# EAGLE design Fathom Drone Pi Shield (EAGLE 6.6.0)

## Sheet 1 of 5
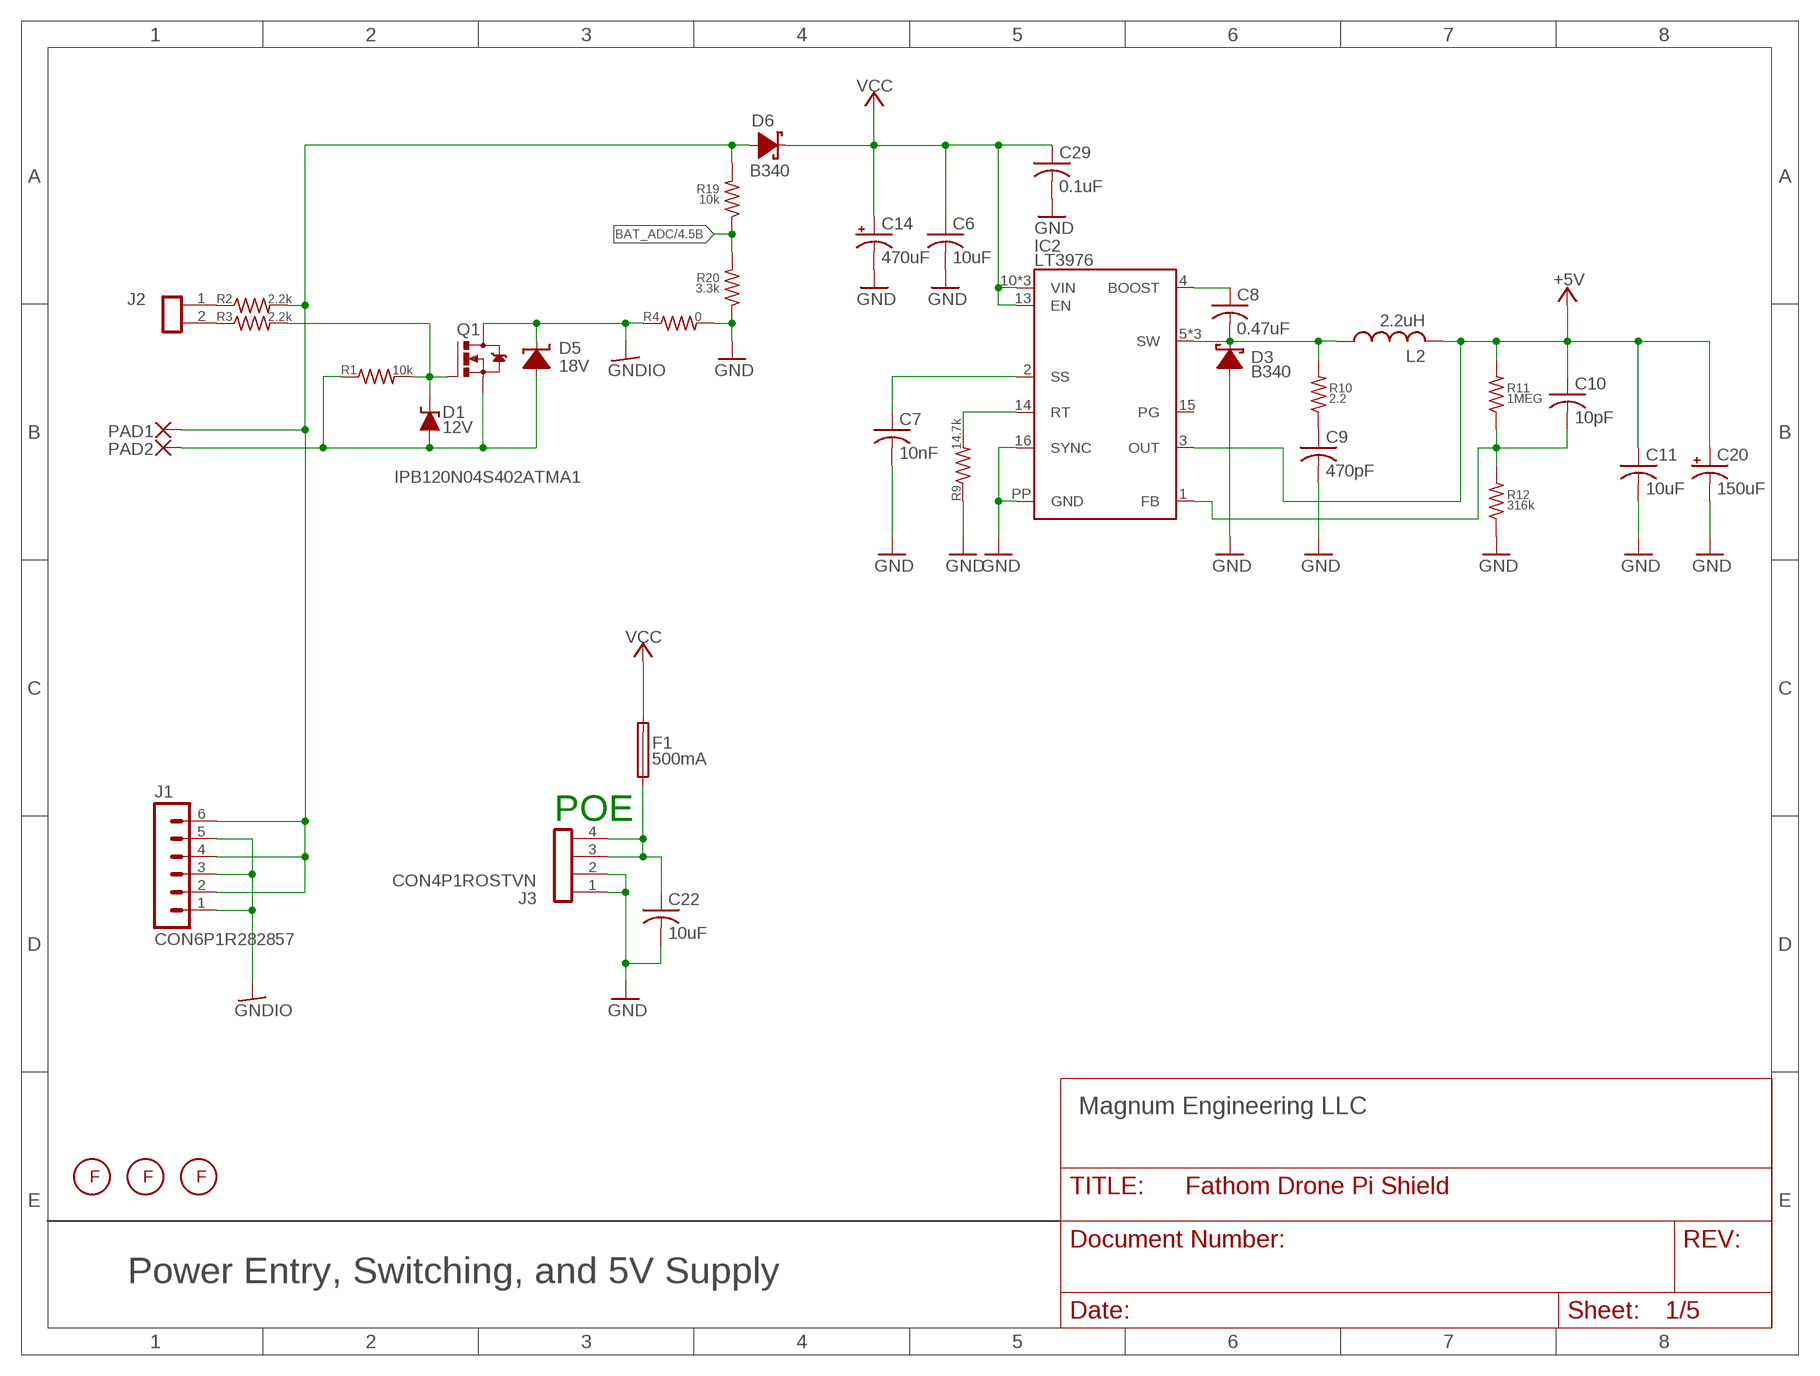
[diagram p0: schematic, sheet 1]

### Parts
C6  10uF  C-USC1206  [C1206]
C7  10nF  CAPACITOR0402  [C0402]
C8  0.47uF  CAPACITOR0603  [C0603]
C9  470pF  CAPACITOR0603  [C0603]
C10  10pF  CAPACITOR0603  [C0603]
C11  10uF  CAPACITOR0805  [C0805]
C14  470uF  CPOL-USE3.5-8  [E3,5-8]
C20  150uF  CPOL-USC  [PANASONIC_C]
C22  10uF  C-USC1206  [C1206]
C29  0.1uF  C-USC0402  [C0402]
D1  12V  ZENERSOT-23  [SOT-23]
D3  B340  DIODE-SCHOTTKYSMA  [SMA]
D5  18V  TVSSMC  [SMC]
D6  B340  DIODE-SCHOTTKYSMA  [SMA]
F1  500mA  FUSEBETTER_1812  [BETTER_LITTELFUSE1812]
FM1  FIDUCIAL1MM  [1MMCIRCLE]
FM2  FIDUCIAL1MM  [1MMCIRCLE]
FM3  FIDUCIAL1MM  [1MMCIRCLE]
IC2  LT3976  [MSOP-16-PP]
J1  CON6P1R282857  [282857-6]
J2  CON2P1ROSTVN  [OSTVN02A150]
J3  CON4P1ROSTVN  [OSTVN04A150]
L2  2.2uH  L-USVLP8040  [VLP8040]
PAD1  WIREPAD5.5/3,0  [5.5/3,0]
PAD2  WIREPAD5.5/3,0  [5.5/3,0]
Q1  IPB120N04S402ATMA1  MOSFET-NTO263  [TO263]
R1  10k  RESISTOR0603  [R0603]
R2  2.2k  RESISTOR0603  [R0603]
R3  2.2k  RESISTOR0603  [R0603]
R4  0  RESISTOR0805  [R0805]
R9  14.7k  RESISTOR0603  [R0603]
R10  2.2  RESISTOR0603  [R0603]
R11  1MEG  RESISTOR0603  [R0603]
R12  316k  RESISTOR0603  [R0603]
R19  10k  RESISTOR0603  [R0603]
R20  3.3k  RESISTOR0402  [R0402]

### Nets
+5V: C10.1 C11.1 C20.+ IC2.3(OUT) L2.P$2 R11.2 ; also sheet 2,3,4
BAT_ADC: R19.1 R20.2 ; also sheet 4
GND: C6.2 C7.2 C9.2 C11.2 C14.- C20.- C22.2 C29.2 D3.A IC2.16(SYNC) IC2.PP(GND) J3.1 J3.2 R4.2 R9.1 R12.1 R20.1 ; also sheet 2,3,4,5
GNDIO: D5.C J1.1 J1.3 J1.5 Q1.3(D) R4.1
N$1: D1.1(A) D5.A PAD2.P$1(P) Q1.2(S) R1.1
N$4: J2.1 R2.1
N$5: J2.2 R3.1
N$12: D6.A J1.2 J1.4 J1.6 PAD1.P$1(P) R2.2 R19.2
N$13: C7.1 IC2.2(SS)
N$14: IC2.14(RT) R9.2
N$15: C8.2 D3.C IC2.5(SW) IC2.6(SW) IC2.7(SW) L2.P$1 R10.2
N$16: C8.1 IC2.4(BOOST)
N$17: C9.1 R10.1
N$18: C10.2 IC2.1(FB) R11.1 R12.2
N$26: D1.3(K) Q1.1(G) R1.2 R3.2
N$44: C22.1 F1.P$1 J3.3 J3.4
VCC: C6.1 C14.+ C29.1 D6.C F1.P$2 IC2.10(VIN) IC2.11(VIN) IC2.12(VIN) IC2.13(EN) ; also sheet 3
Unconnected: IC2.15(PG)

### Notes on the sheet
- POE

## Sheet 2 of 5
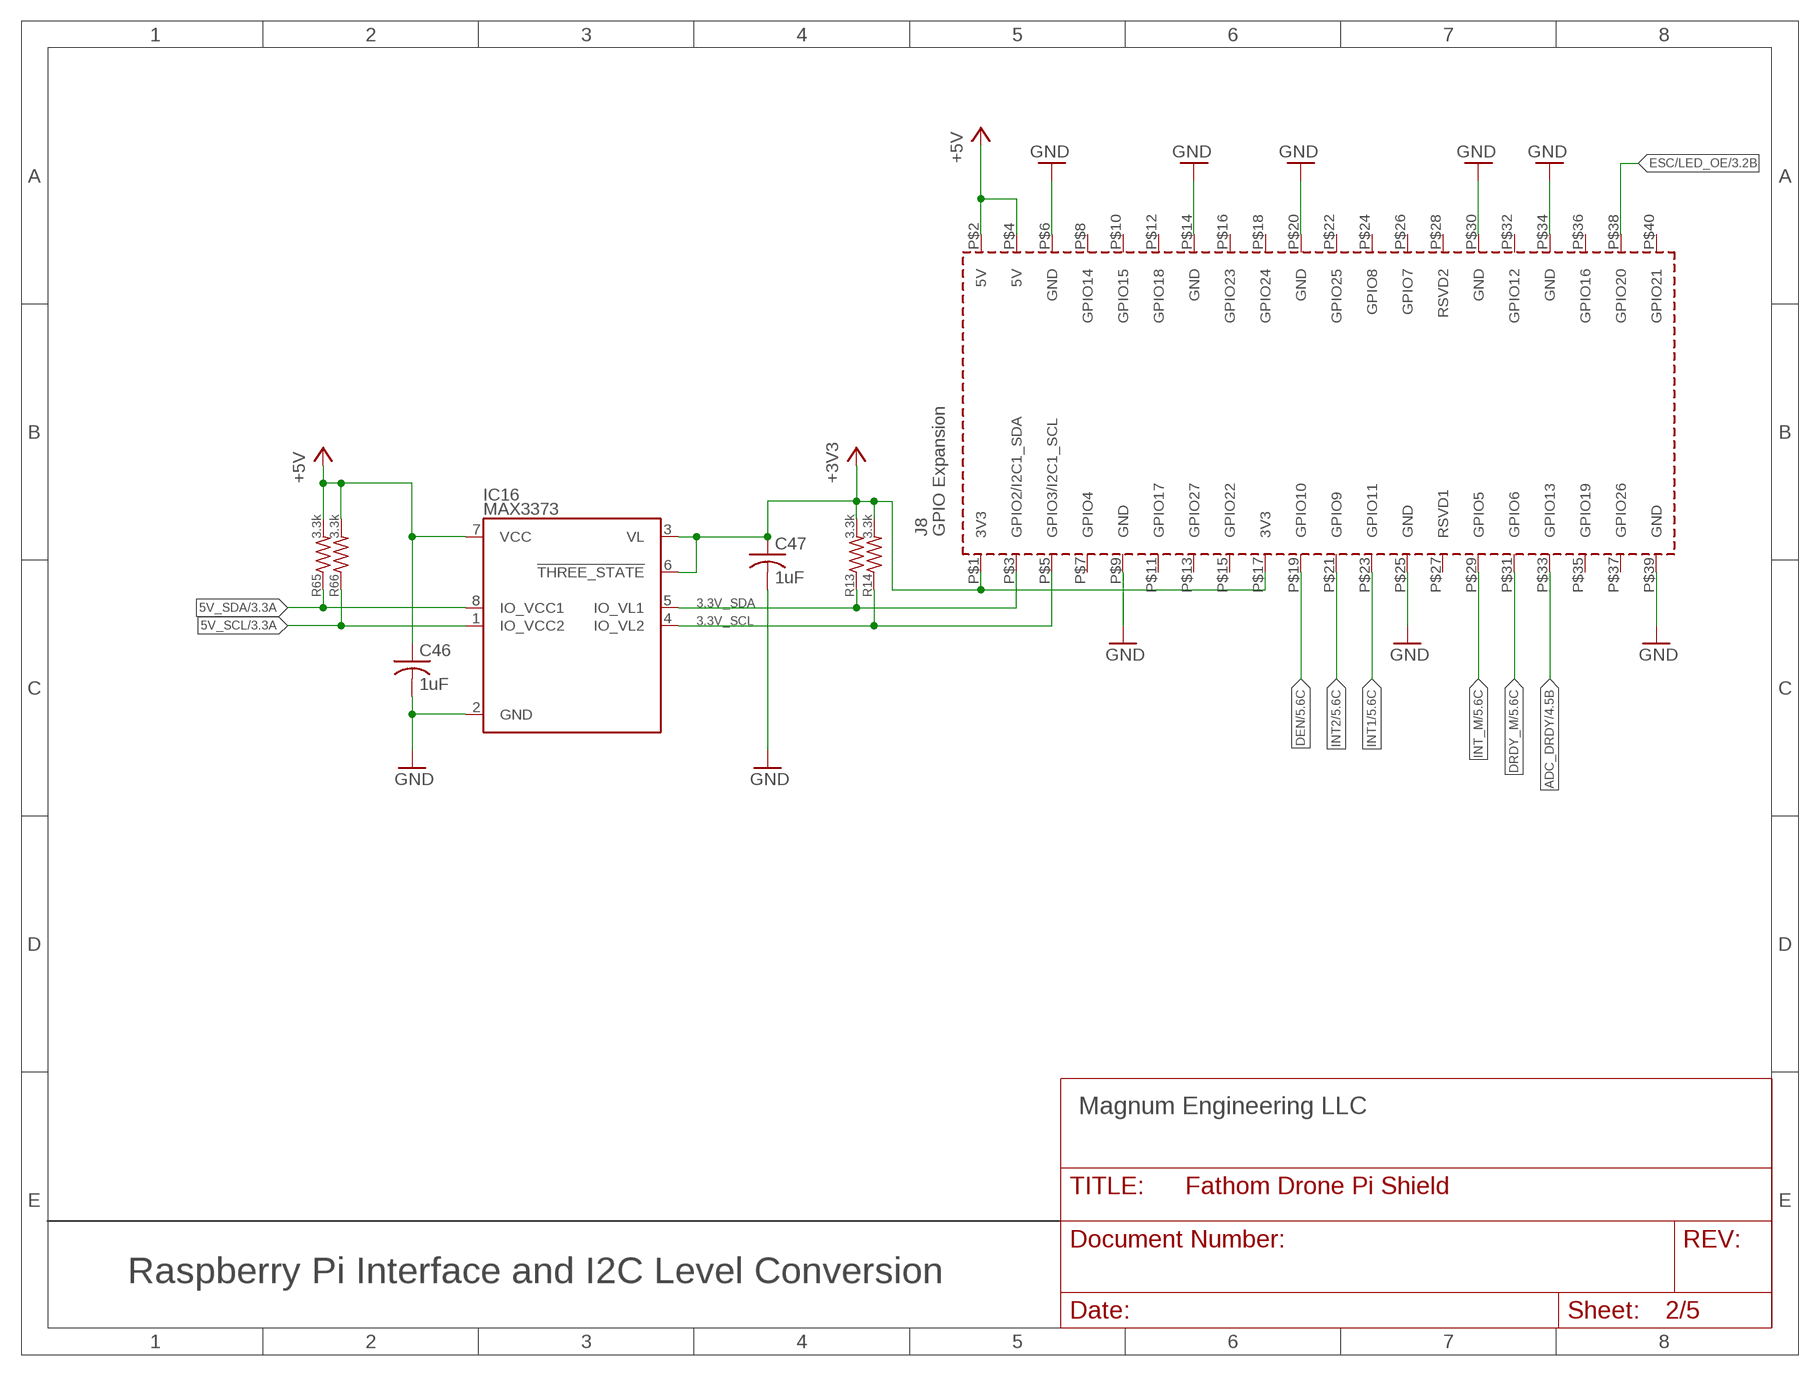
[diagram p1: schematic, sheet 2]

### Parts
C46  1uF  CAPACITOR0402  [C0402]
C47  1uF  CAPACITOR0402  [C0402]
IC16  MAX3373  [TS8]
PCB1  RPI3  [RPI3]
R13  3.3k  RESISTOR0402  [R0402]
R14  3.3k  RESISTOR0402  [R0402]
R65  3.3k  RESISTOR0402  [R0402]
R66  3.3k  RESISTOR0402  [R0402]

### Nets
3.3V_SCL: IC16.4(IO_VL2) PCB1.P$5(GPIO3/I2C1_SCL) R14.1 ; also sheet 5
3.3V_SDA: IC16.5(IO_VL1) PCB1.P$3(GPIO2/I2C1_SDA) R13.1 ; also sheet 5
5V_SCL: IC16.1(IO_VCC2) R66.1 ; also sheet 3,4
5V_SDA: IC16.8(IO_VCC1) R65.1 ; also sheet 3,4
+3V3: C47.1 IC16.3(VL) IC16.6(!THREE_STATE) PCB1.P$1(3V3) PCB1.P$17(3V3) R13.2 R14.2 ; also sheet 4,5
+5V: C46.1 IC16.7(VCC) PCB1.P$2(5V) PCB1.P$4(5V) R65.2 R66.2 ; also sheet 1,3,4
ADC_DRDY: PCB1.P$33(GPIO13) ; also sheet 4
DEN: PCB1.P$19(GPIO10) ; also sheet 5
DRDY_M: PCB1.P$31(GPIO6) ; also sheet 5
ESC/LED_OE: PCB1.P$38(GPIO20) ; also sheet 3
GND: C46.2 C47.2 IC16.2(GND) PCB1.P$6(GND) PCB1.P$9(GND) PCB1.P$14(GND) PCB1.P$20(GND) PCB1.P$25(GND) PCB1.P$30(GND) PCB1.P$34(GND) PCB1.P$39(GND) ; also sheet 1,3,4,5
INT1: PCB1.P$23(GPIO11) ; also sheet 5
INT2: PCB1.P$21(GPIO9) ; also sheet 5
INT_M: PCB1.P$29(GPIO5) ; also sheet 5
Unconnected: PCB1.P$7(GPIO4) PCB1.P$8(GPIO14) PCB1.P$10(GPIO15) PCB1.P$11(GPIO17) PCB1.P$12(GPIO18) PCB1.P$13(GPIO27) PCB1.P$15(GPIO22) PCB1.P$16(GPIO23) PCB1.P$18(GPIO24) PCB1.P$22(GPIO25) PCB1.P$24(GPIO8) PCB1.P$26(GPIO7) PCB1.P$27(RSVD1) PCB1.P$28(RSVD2) PCB1.P$32(GPIO12) PCB1.P$35(GPIO19) PCB1.P$36(GPIO16) PCB1.P$37(GPIO26) PCB1.P$40(GPIO21)

## Sheet 3 of 5
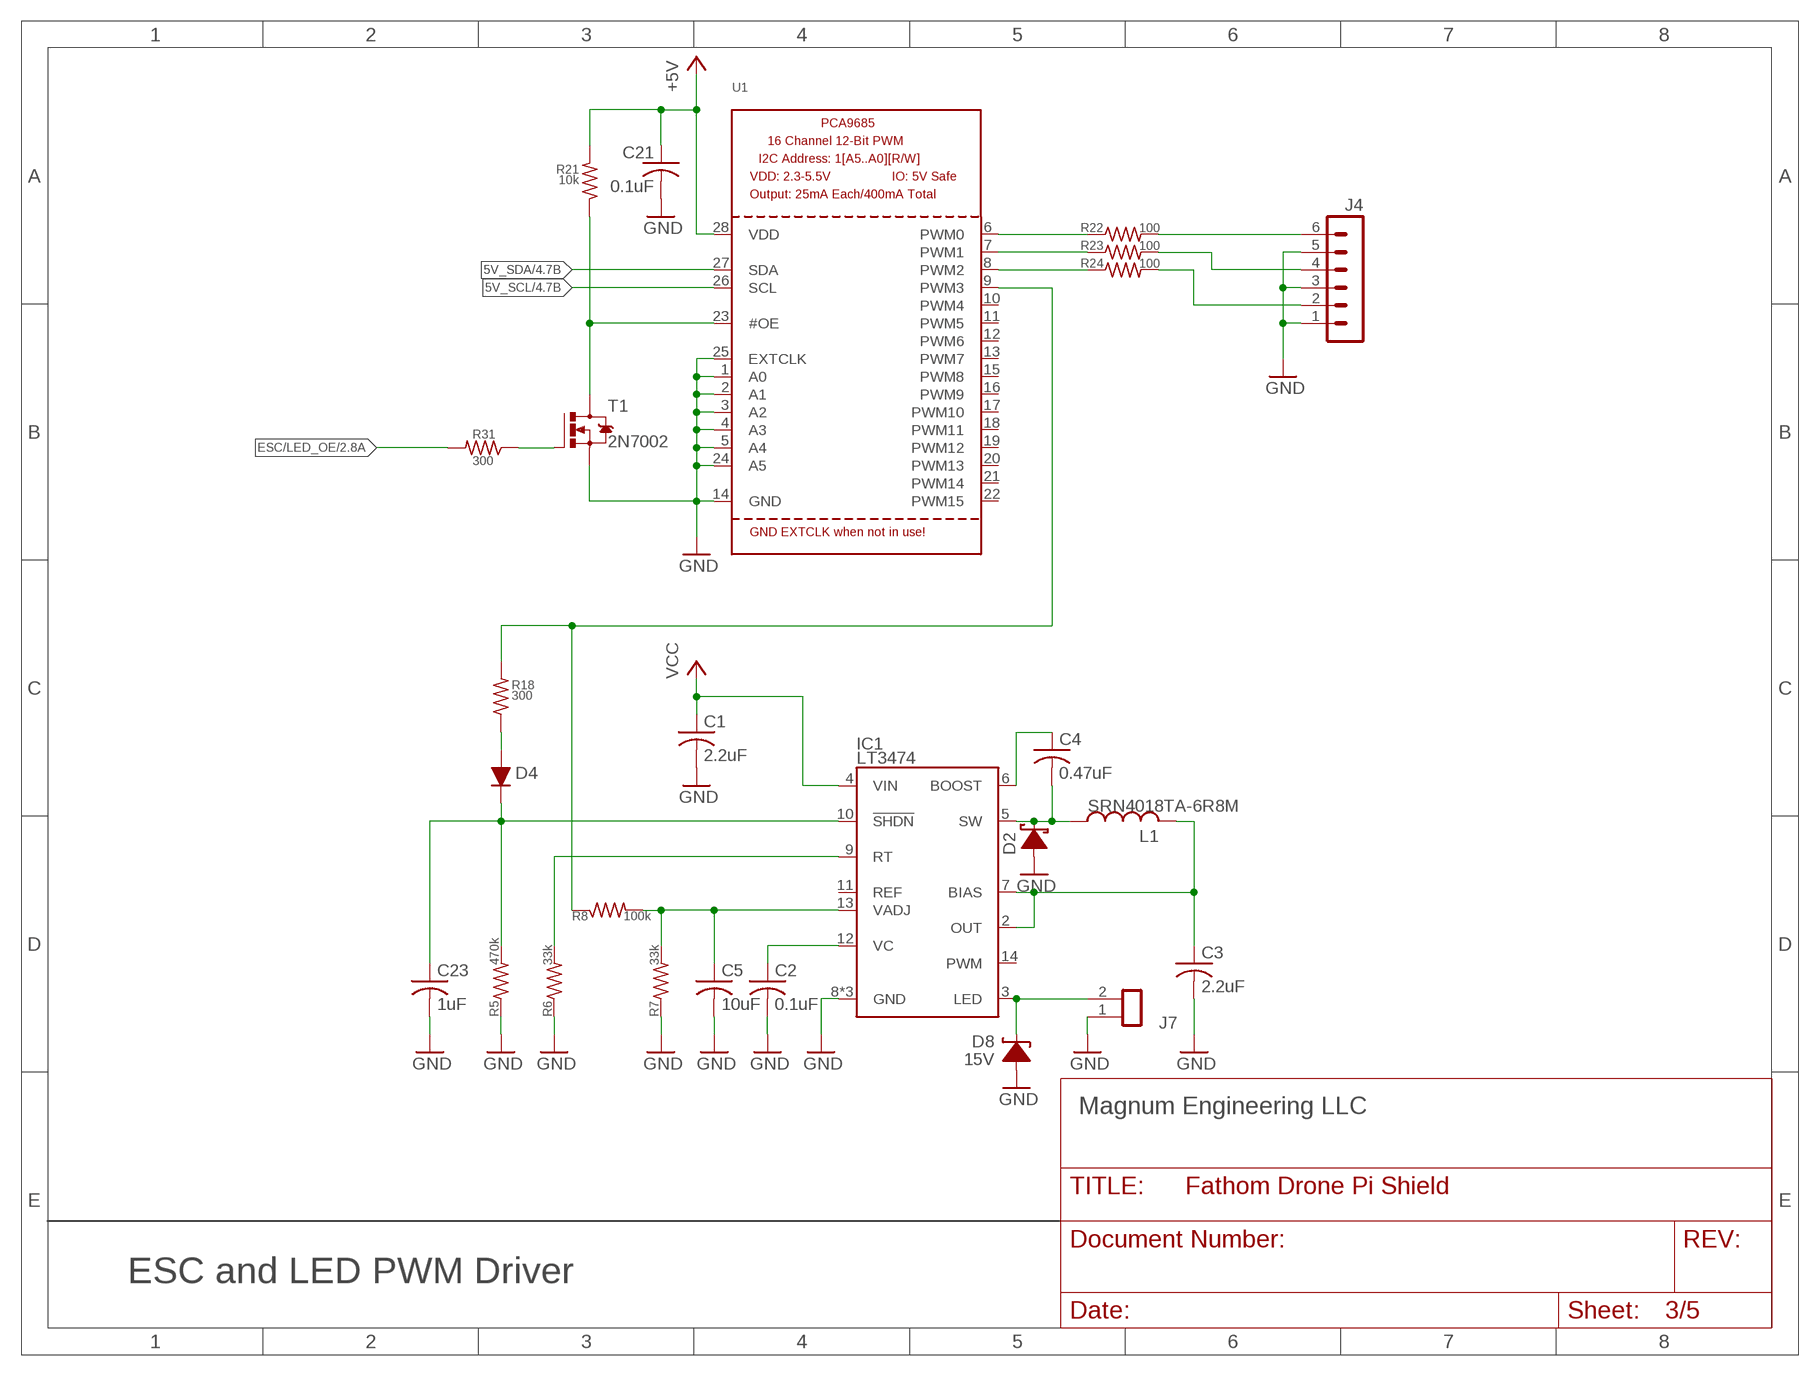
[diagram p2: schematic, sheet 3]

### Parts
C1  2.2uF  CAPACITOR0603  [C0603]
C2  0.1uF  CAPACITOR0402  [C0402]
C3  2.2uF  CAPACITOR0603  [C0603]
C4  0.47uF  CAPACITOR0603  [C0603]
C5  10uF  CAPACITOR0805  [C0805]
C21  0.1uF  CAPACITOR0402  [C0402]
C23  1uF  CAPACITOR0402  [C0402]
D2  DIODE-SCHOTTKYSMA  [SMA]
D4  DIODESOD-123  [SOD-123]
D8  15V  TVSSOD123FL  [SOD123FL]
IC1  LT3474  [TSSOP16_PP]
J4  CON6P1ROSTVN  [OSTVN06A150]
J7  CON2P1ROSTVN  [OSTVN02A150]
L1  SRN4018TA-6R8M  L-US4026  [L-4026]
R5  470k  RESISTOR0603  [R0603]
R6  33k  RESISTOR0603  [R0603]
R7  33k  RESISTOR0603  [R0603]
R8  100k  RESISTOR0603  [R0603]
R18  300  RESISTOR0402  [R0402]
R21  10k  RESISTOR0603  [R0603]
R22  100  RESISTOR0603  [R0603]
R23  100  RESISTOR0603  [R0603]
R24  100  RESISTOR0603  [R0603]
R31  300  RESISTOR0402  [R0402]
T1  2N7002  N-MOSFET  [SOT-23]
U1  PCA9685  [TSSOP28]

### Nets
5V_SCL: U1.26(SCL) ; also sheet 2,4
5V_SDA: U1.27(SDA) ; also sheet 2,4
+5V: C21.1 R21.2 U1.28(VDD) ; also sheet 1,2,4
ESC/LED_OE: R31.2 ; also sheet 2
GND: C1.2 C2.2 C3.2 C5.2 C21.2 C23.2 D2.A D8.A IC1.8(GND) IC1.15(GND) IC1.PP(GND) J4.1 J4.3 J4.5 J7.1 R5.1 R6.1 R7.1 T1.2(S) U1.1(A0) U1.2(A1) U1.3(A2) U1.4(A3) U1.5(A4) U1.14(GND) U1.24(A5) U1.25(EXTCLK) ; also sheet 1,2,4,5
N$2: IC1.9(RT) R6.2
N$3: R21.1 T1.3(D) U1.23(#OE)
N$6: C2.1 IC1.12(VC)
N$7: D8.K(C) IC1.3(LED) J7.2
N$8: C3.1 IC1.2(OUT) IC1.7(BIAS) L1.P$2
N$9: C4.2 D2.C IC1.5(SW) L1.P$1
N$10: C4.1 IC1.6(BOOST)
N$11: C5.1 IC1.13(VADJ) R7.2 R8.2
N$27: R22.1 U1.6(PWM0)
N$28: R23.1 U1.7(PWM1)
N$29: R24.1 U1.8(PWM2)
N$30: R8.1 R18.2 U1.9(PWM3)
N$31: J4.6 R22.2
N$34: J4.4 R23.2
N$35: J4.2 R24.2
N$36: C23.1 D4.K IC1.10(!SHDN) R5.2
N$37: D4.A R18.1
N$41: R31.1 T1.1(G)
VCC: C1.1 IC1.4(VIN) ; also sheet 1
Unconnected: IC1.11(REF) IC1.14(PWM) U1.10(PWM4) U1.11(PWM5) U1.12(PWM6) U1.13(PWM7) U1.15(PWM8) U1.16(PWM9) U1.17(PWM10) U1.18(PWM11) U1.19(PWM12) U1.20(PWM13) U1.21(PWM14) U1.22(PWM15)

## Sheet 4 of 5
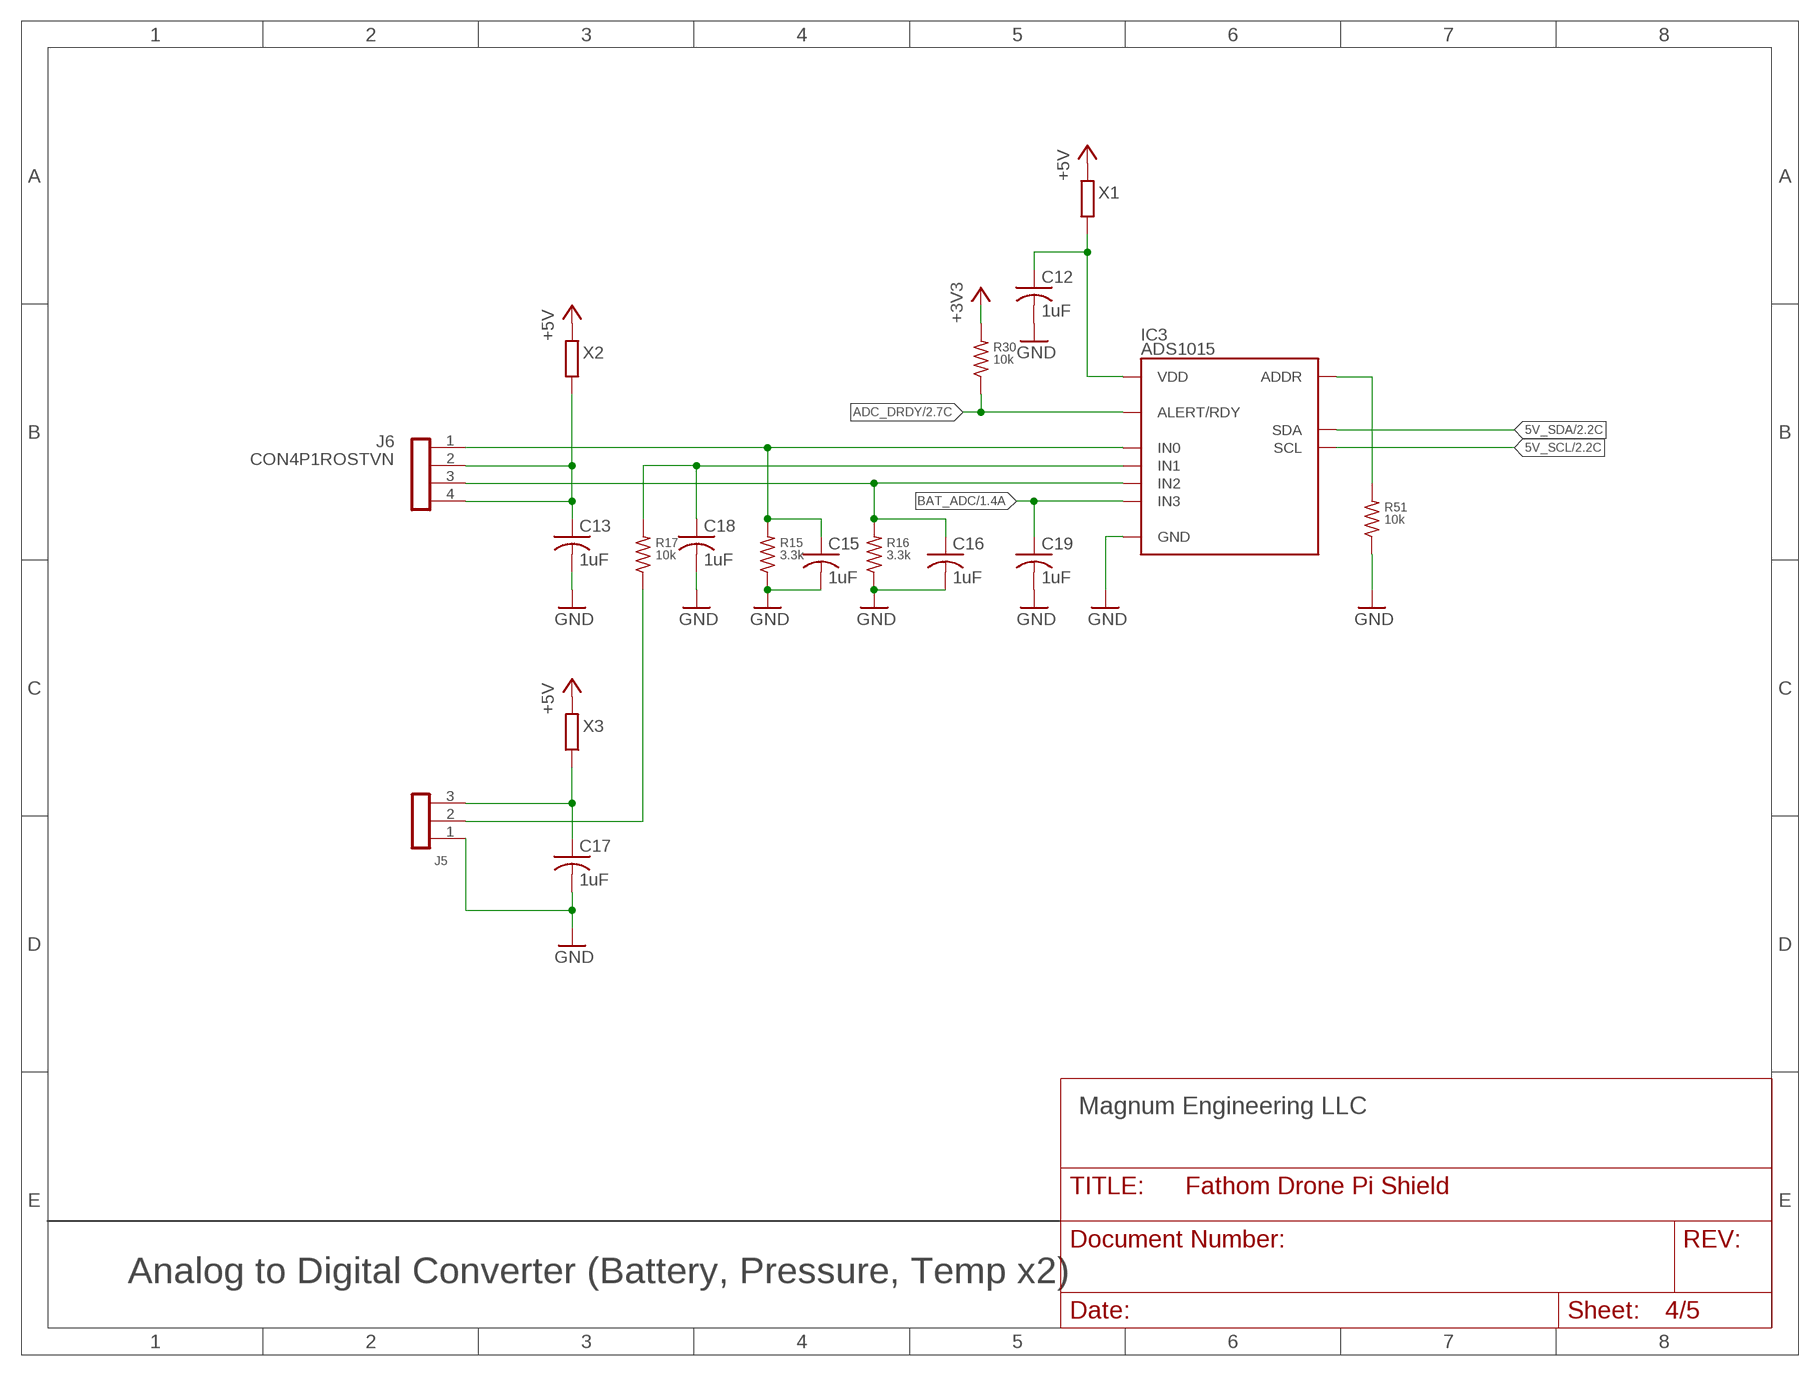
[diagram p3: schematic, sheet 4]

### Parts
C12  1uF  CAPACITOR0402  [C0402]
C13  1uF  CAPACITOR0402  [C0402]
C15  1uF  CAPACITOR0402  [C0402]
C16  1uF  CAPACITOR0402  [C0402]
C17  1uF  CAPACITOR0402  [C0402]
C18  1uF  CAPACITOR0402  [C0402]
C19  1uF  CAPACITOR0402  [C0402]
IC3  ADS1015  [MSOP10]
J5  CON3P1ROSTVN  [OSTVN03A150]
J6  CON4P1ROSTVN  [OSTVN04A150]
R15  3.3k  RESISTOR0402  [R0402]
R16  3.3k  RESISTOR0402  [R0402]
R17  10k  RESISTOR0603  [R0603]
R30  10k  RESISTOR0603  [R0603]
R51  10k  RESISTOR0603  [R0603]
X1  PASSIVE0603  [R0603@1]
X2  PASSIVE0603  [R0603@1]
X3  PASSIVE0603  [R0603@1]

### Nets
5V_SCL: IC3.10(SCL) ; also sheet 2,3
5V_SDA: IC3.9(SDA) ; also sheet 2,3
+3V3: R30.2 ; also sheet 2,5
+5V: X1.2 X2.2 X3.2 ; also sheet 1,2,3
ADC_DRDY: IC3.2(ALERT/RDY) R30.1 ; also sheet 2
BAT_ADC: C19.1 IC3.7(IN3) ; also sheet 1
GND: C12.2 C13.2 C15.2 C16.2 C17.2 C18.2 C19.2 IC3.3(GND) J5.1 R15.1 R16.1 R51.1 ; also sheet 1,2,3,5
N$19: C15.1 IC3.4(IN0) J6.1 R15.2
N$20: C16.1 IC3.6(IN2) J6.3 R16.2
N$21: C13.1 J6.2 J6.4 X2.1
N$22: C17.1 J5.3 X3.1
N$23: C12.1 IC3.8(VDD) X1.1
N$24: J5.2 R17.1
N$25: C18.1 IC3.5(IN1) R17.2
N$79: IC3.1(ADDR) R51.2

## Sheet 5 of 5
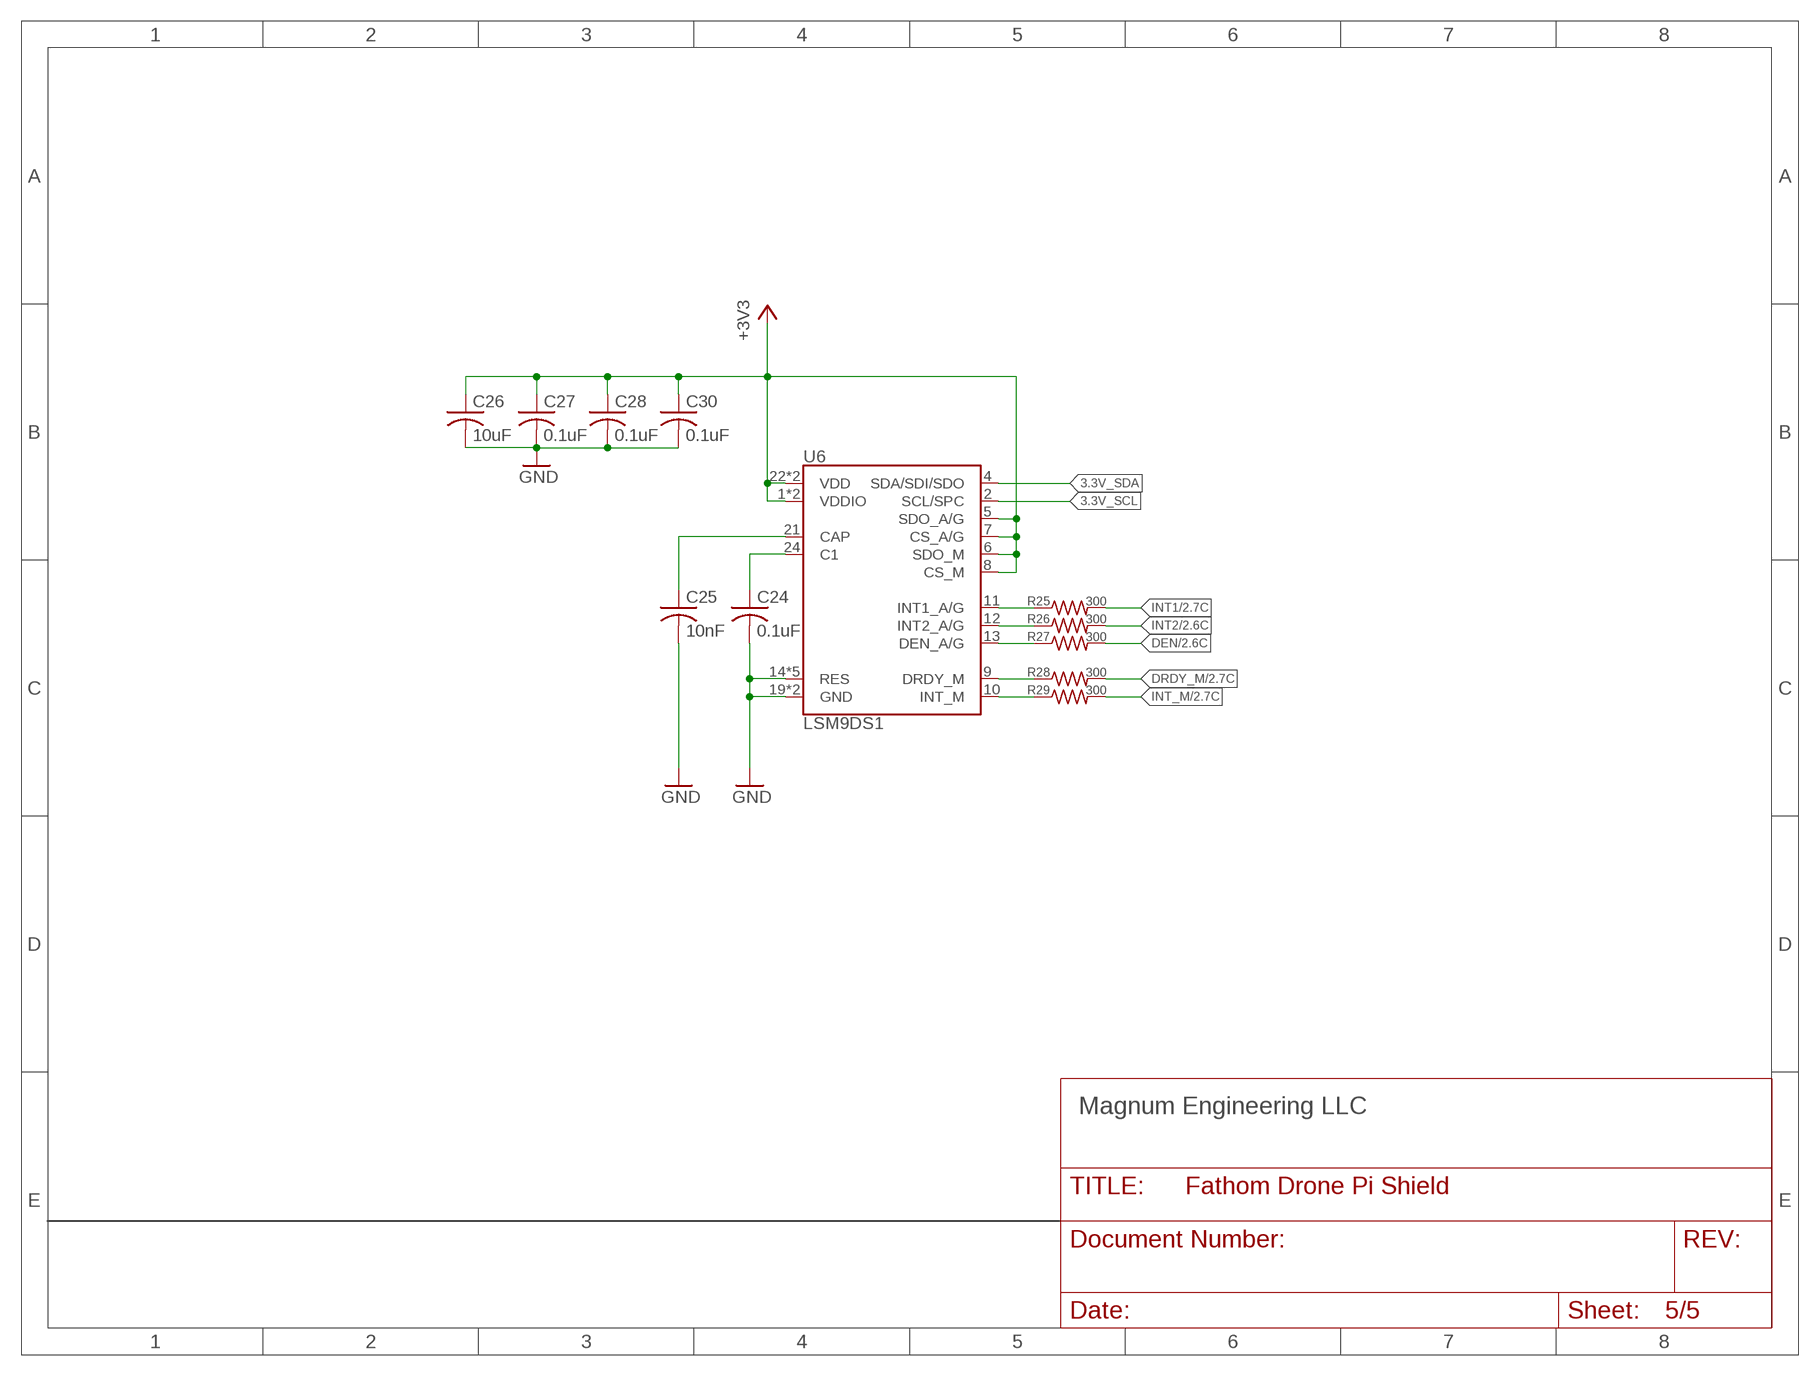
[diagram p4: schematic, sheet 5]

### Parts
C24  0.1uF  CAPACITOR0402  [C0402]
C25  10nF  CAPACITOR0402  [C0402]
C26  10uF  CAPACITOR0805  [C0805]
C27  0.1uF  CAPACITOR0402  [C0402]
C28  0.1uF  CAPACITOR0402  [C0402]
C30  0.1uF  CAPACITOR0402  [C0402]
R25  300  RESISTOR0402  [R0402]
R26  300  RESISTOR0402  [R0402]
R27  300  RESISTOR0402  [R0402]
R28  300  RESISTOR0402  [R0402]
R29  300  RESISTOR0402  [R0402]
U6  LSM9DS1  [LGA24-8X4]

### Nets
3.3V_SCL: U6.2(SCL/SPC) ; also sheet 2
3.3V_SDA: U6.4(SDA/SDI/SDO) ; also sheet 2
+3V3: C26.1 C27.1 C28.1 C30.1 U6.1(VDDIO) U6.3(VDDIO) U6.5(SDO_A/G) U6.6(SDO_M) U6.7(CS_A/G) U6.8(CS_M) U6.22(VDD) U6.23(VDD) ; also sheet 2,4
DEN: R27.2 ; also sheet 2
DRDY_M: R28.2 ; also sheet 2
GND: C24.2 C25.2 C26.2 C27.2 C28.2 C30.2 U6.14(RES) U6.15(RES) U6.16(RES) U6.17(RES) U6.18(RES) U6.19(GND) U6.20(GND) ; also sheet 1,2,3,4
INT1: R25.2 ; also sheet 2
INT2: R26.2 ; also sheet 2
INT_M: R29.2 ; also sheet 2
N$32: R25.1 U6.11(INT1_A/G)
N$33: R26.1 U6.12(INT2_A/G)
N$38: R27.1 U6.13(DEN_A/G)
N$39: R28.1 U6.9(DRDY_M)
N$40: R29.1 U6.10(INT_M)
N$42: C24.1 U6.24(C1)
N$43: C25.1 U6.21(CAP)

## Library data of the parts
C1-C5 C7-C13 C15-C19 C21 C23-C28 C30 C46 C47 = Magnum Stock Parts:CAPACITOR
C6 C22 C29 = Magnum:C-US: CAPACITOR, American symbol
C14 C20 = Magnum:CPOL-US: POLARIZED CAPACITOR, American symbol
D1 = Magnum Stock Parts:ZENER: Zener Diode
D2 D3 D6 = Magnum Stock Parts:DIODE-SCHOTTKY: Schottky Diode
D4 = Magnum Stock Parts:DIODE: Diode
D5 D8 = ads4:TVS: 2-terminal Transient Voltage Suppressor
F1 = ads4:FUSE: Fuse
FM1-FM3 = ads4:FIDUCIAL: Fiducial marks
IC1 = Magnum:LT3474
IC2 = Magnum:LT3976
IC3 = Magnum:ADS1015
IC16 = Magnum:MAX3373
J1 J4 = Magnum:CON6P1R
J2 J7 = Magnum:CON2P1R: 2-Pin Single Row Header Strip
J3 J6 = Magnum:CON4P1R
J5 = Magnum:CON3P1R
L1 L2 = Magnum:L-US: INDUCTOR, American symbol
PAD1 PAD2 = wirepad:WIREPAD: Wire PAD connect wire on PCB
PCB1 = e14_Rpi3_RevA:RPI3: Device for Raspberry Pi 3 board created by Dave Young for www.element14.com More information and support community is available at https://www.element14.com/community/community/raspberry-pi
Q1 = Magnum:MOSFET-N: N-Channel MOSFET
R1-R31 R51 R65 R66 = Magnum Stock Parts:RESISTOR
T1 = Magnum Stock Parts:N-MOSFET: 2N7002 or Similar
U1 = adafruit:PCA9685: PCA9685 - 16 Channel 12-Bit I2C PWM Controller 5.0V tolerant 16 channel, 12-bit I2C PWM controller with 25mA per output (max. 400mA total) Digikey: 568-5931-1-ND
U6 = SparkFun-Sensors:LSM9DS1: LSM9DS1 3D accelerometer, gyroscope & magnetometer The LSM9DS1 is a system-in-package featuring a 3D digital linear acceleration sensor, a 3D digital angular rate sensor, and a 3D digital magnetic sensor. The LSM9DS1 has a linear acceleration full scale of ±2g/±4g/±8/±16 g, a magnetic field full scale of ±4/±8/±12/±16 gauss and an angular rate of ±245/±500/±2000 dps. The LSM9DS1 includes an I2 C serial bus interface supporting standard and fast mode (100 kHz and 400 kHz) and an SPI serial standard interface. Magnetic, accelerometer and gyroscope sensing can be enabled or set in power-down mode separately for smart power management. The LSM9DS1 is available in a plastic land grid array package (LGA) and it is guaranteed to operate over an extended temperature range from -40 °C to +85 °C.; PROD_ID: IC-12536
X1-X3 = Magnum Stock Parts:PASSIVE

## Board
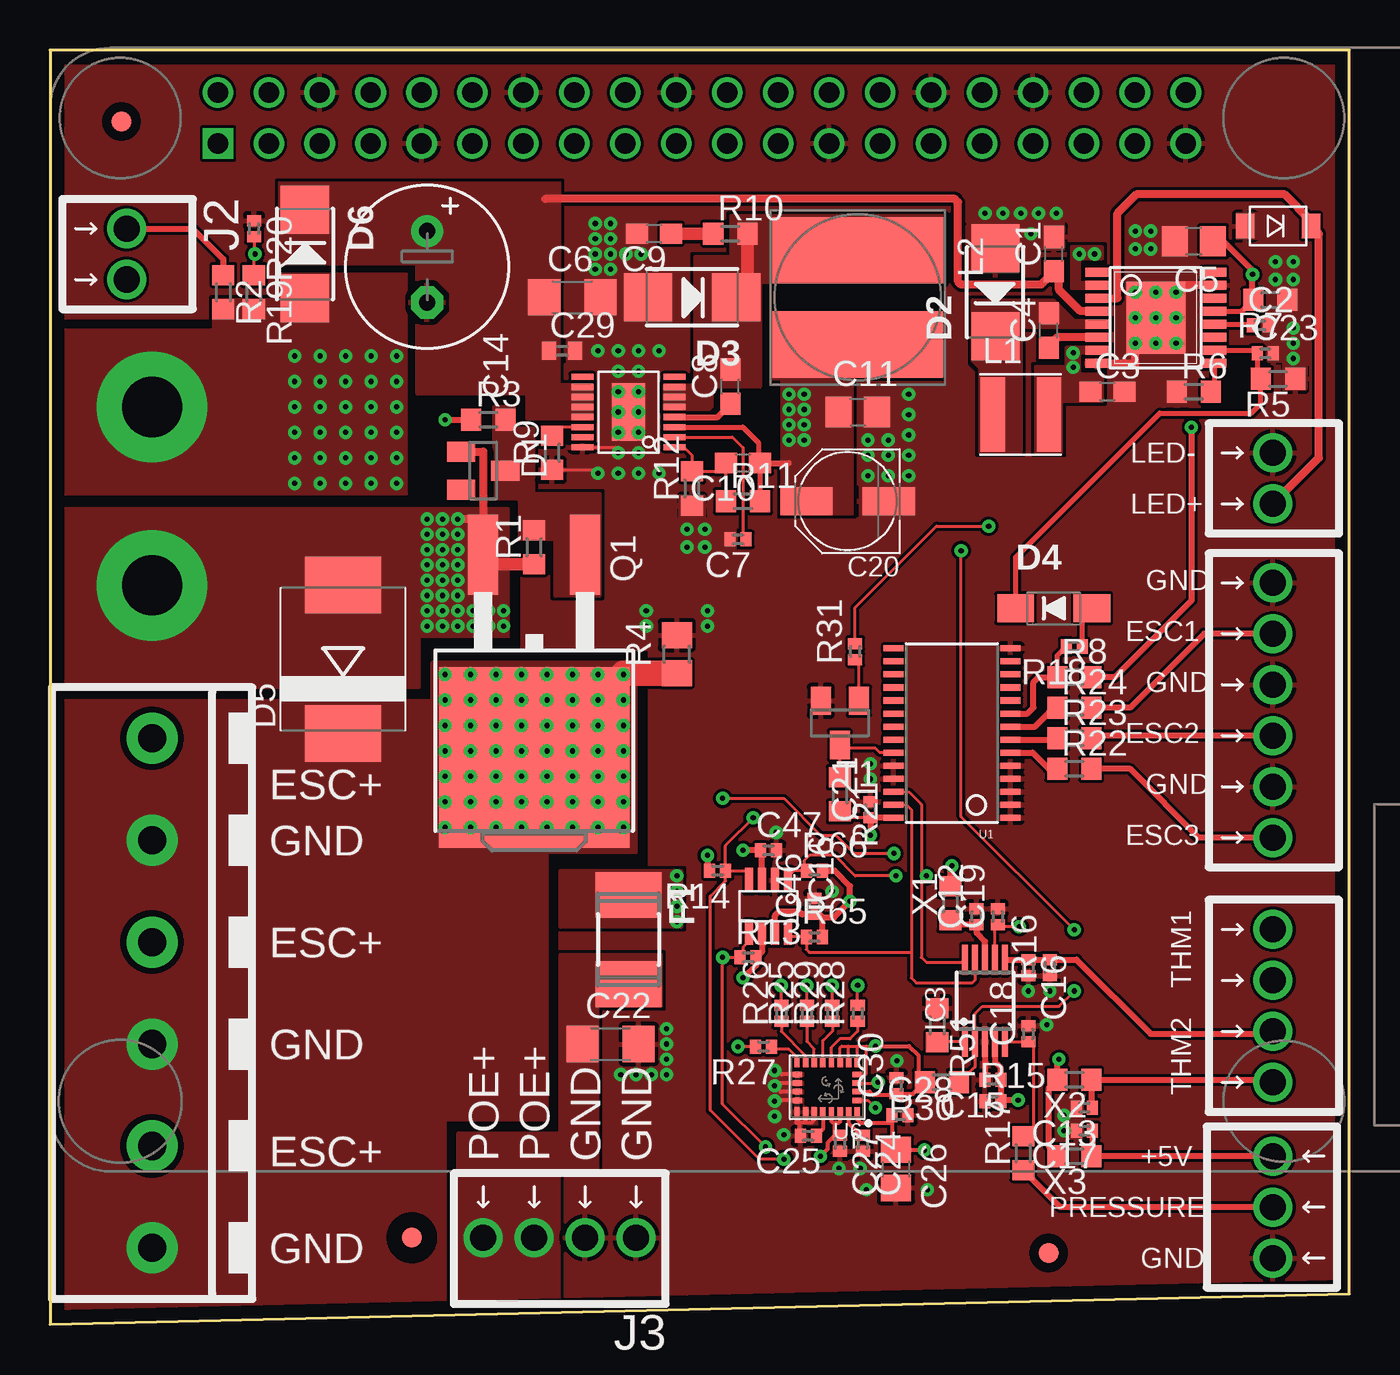
[diagram p5: board, top side]
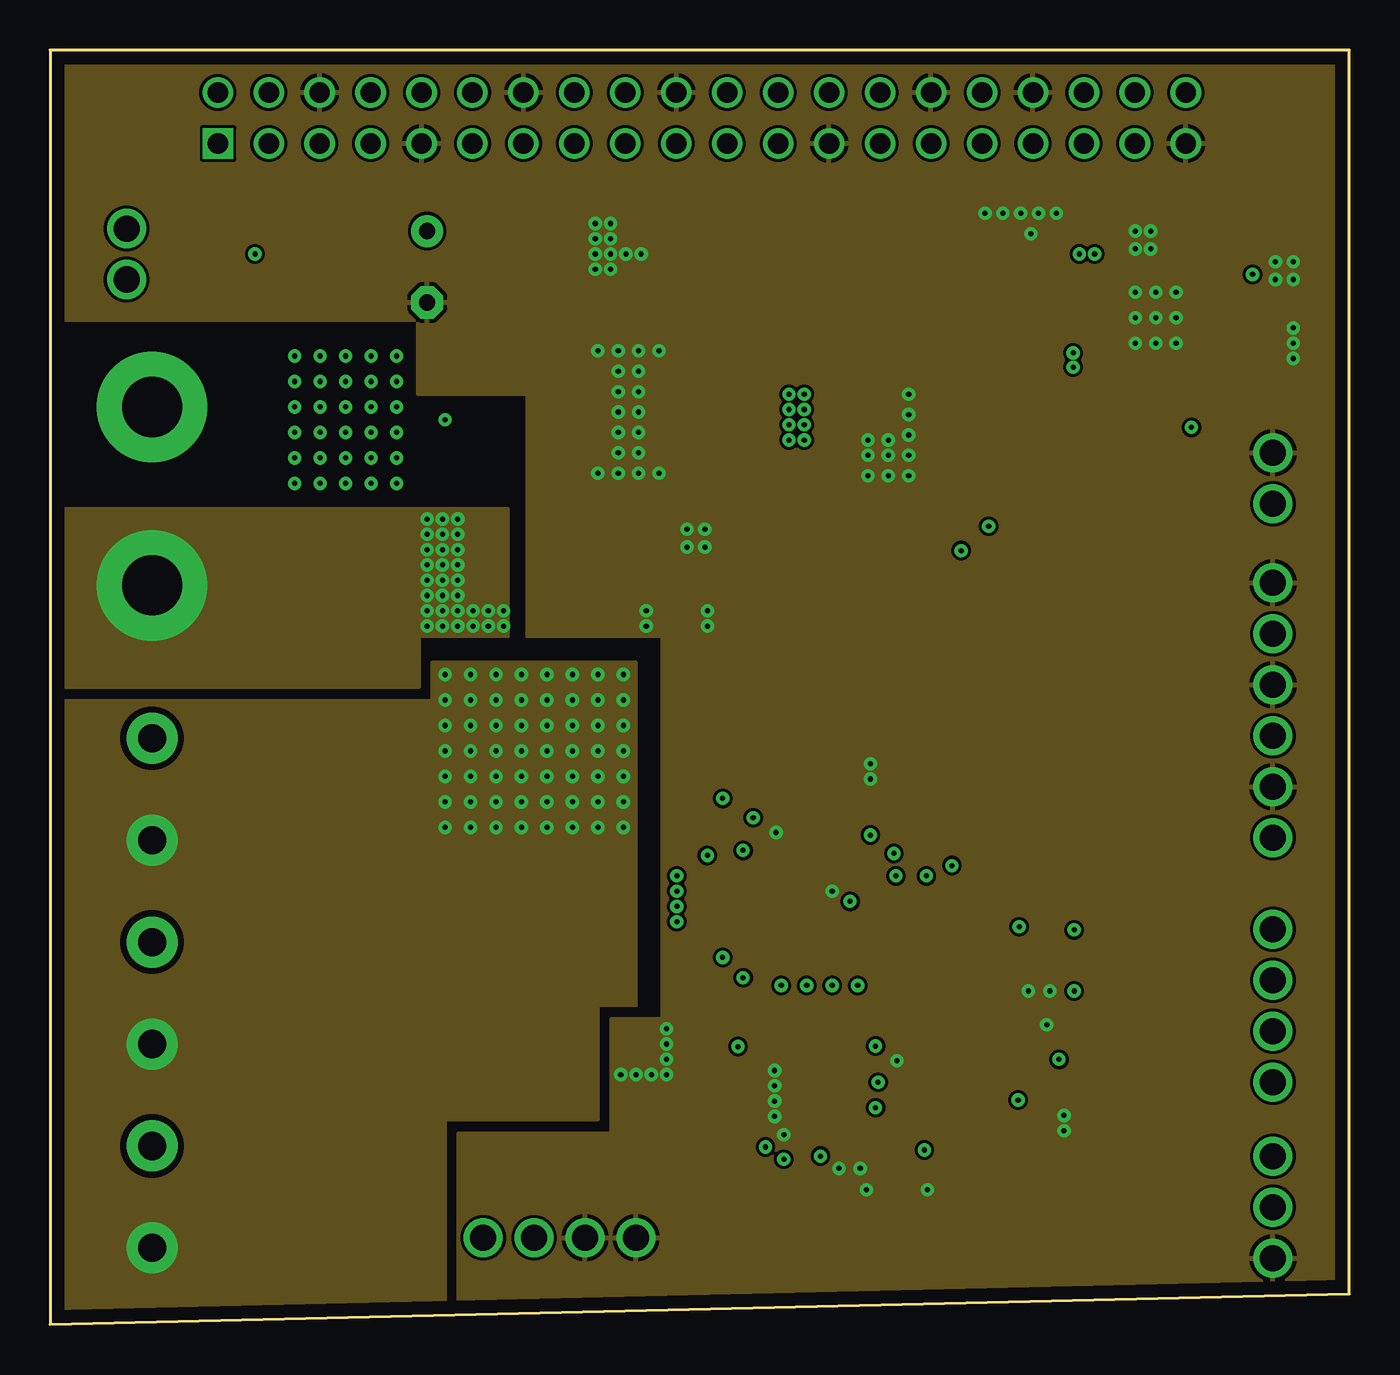
[diagram p6: board, inner layer Route2]
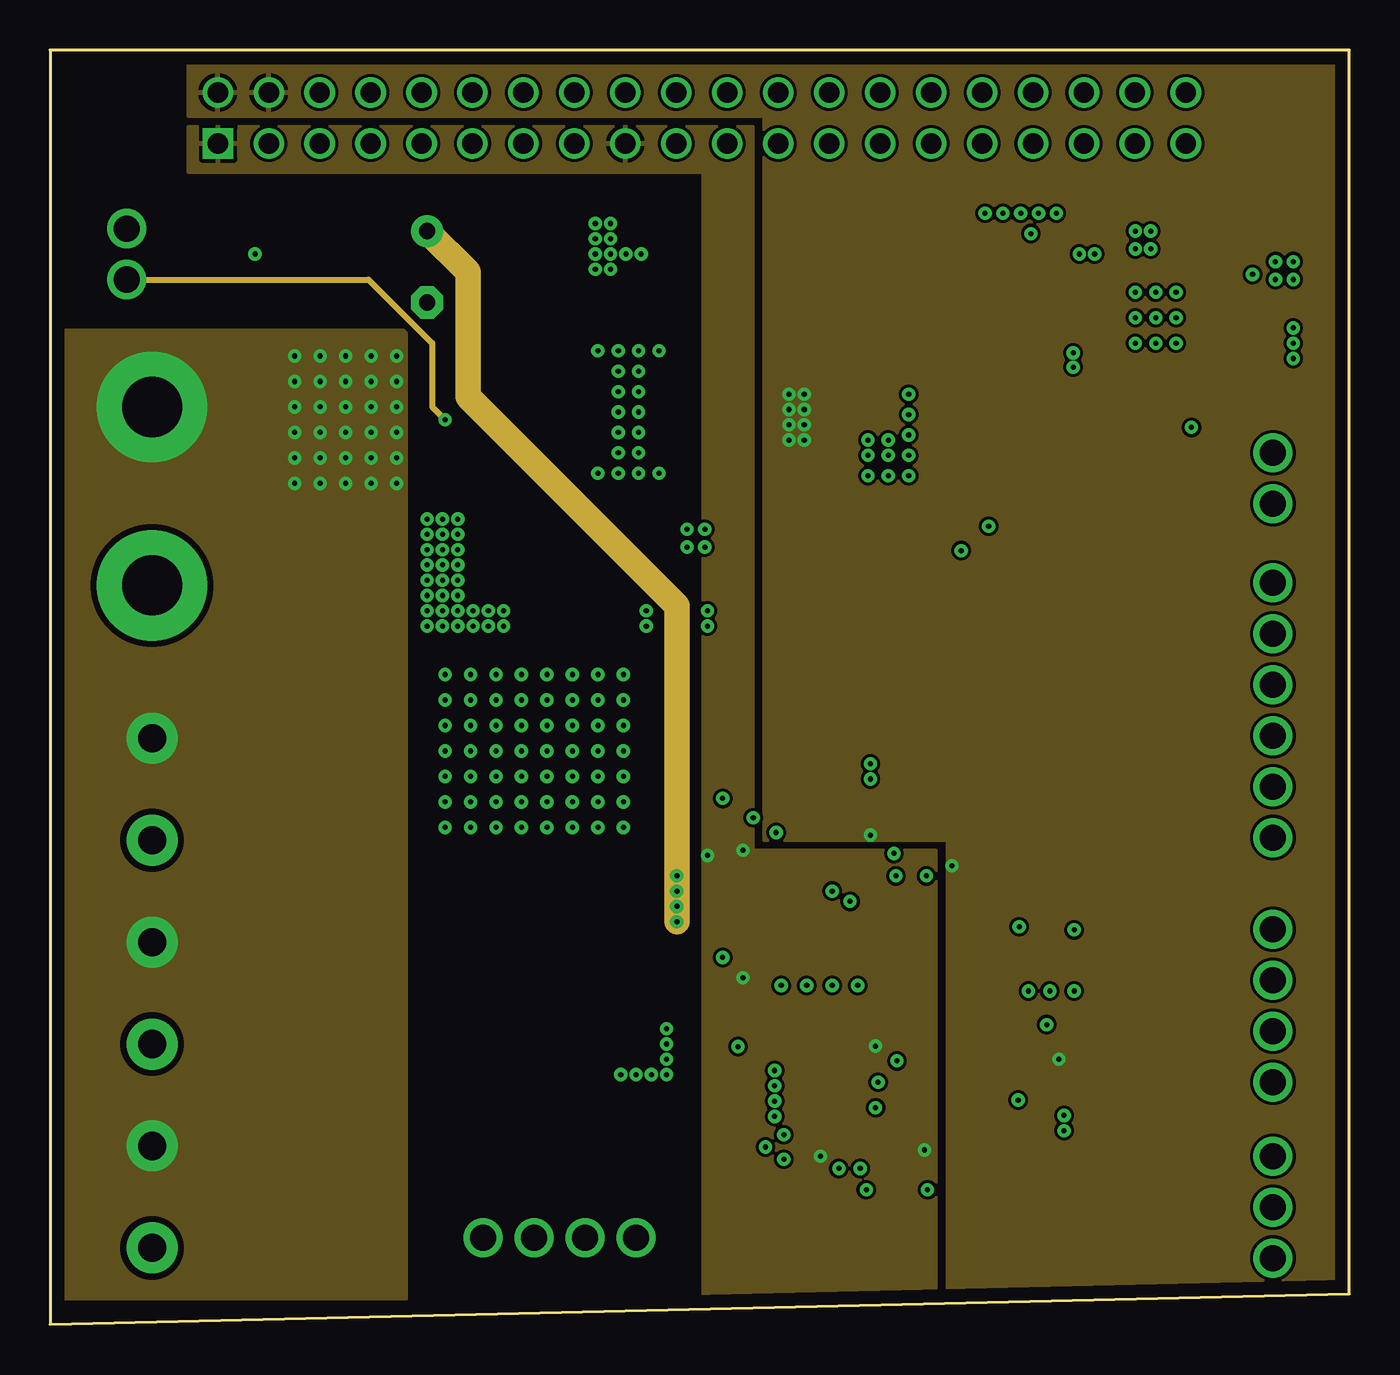
[diagram p7: board, inner layer Route15]
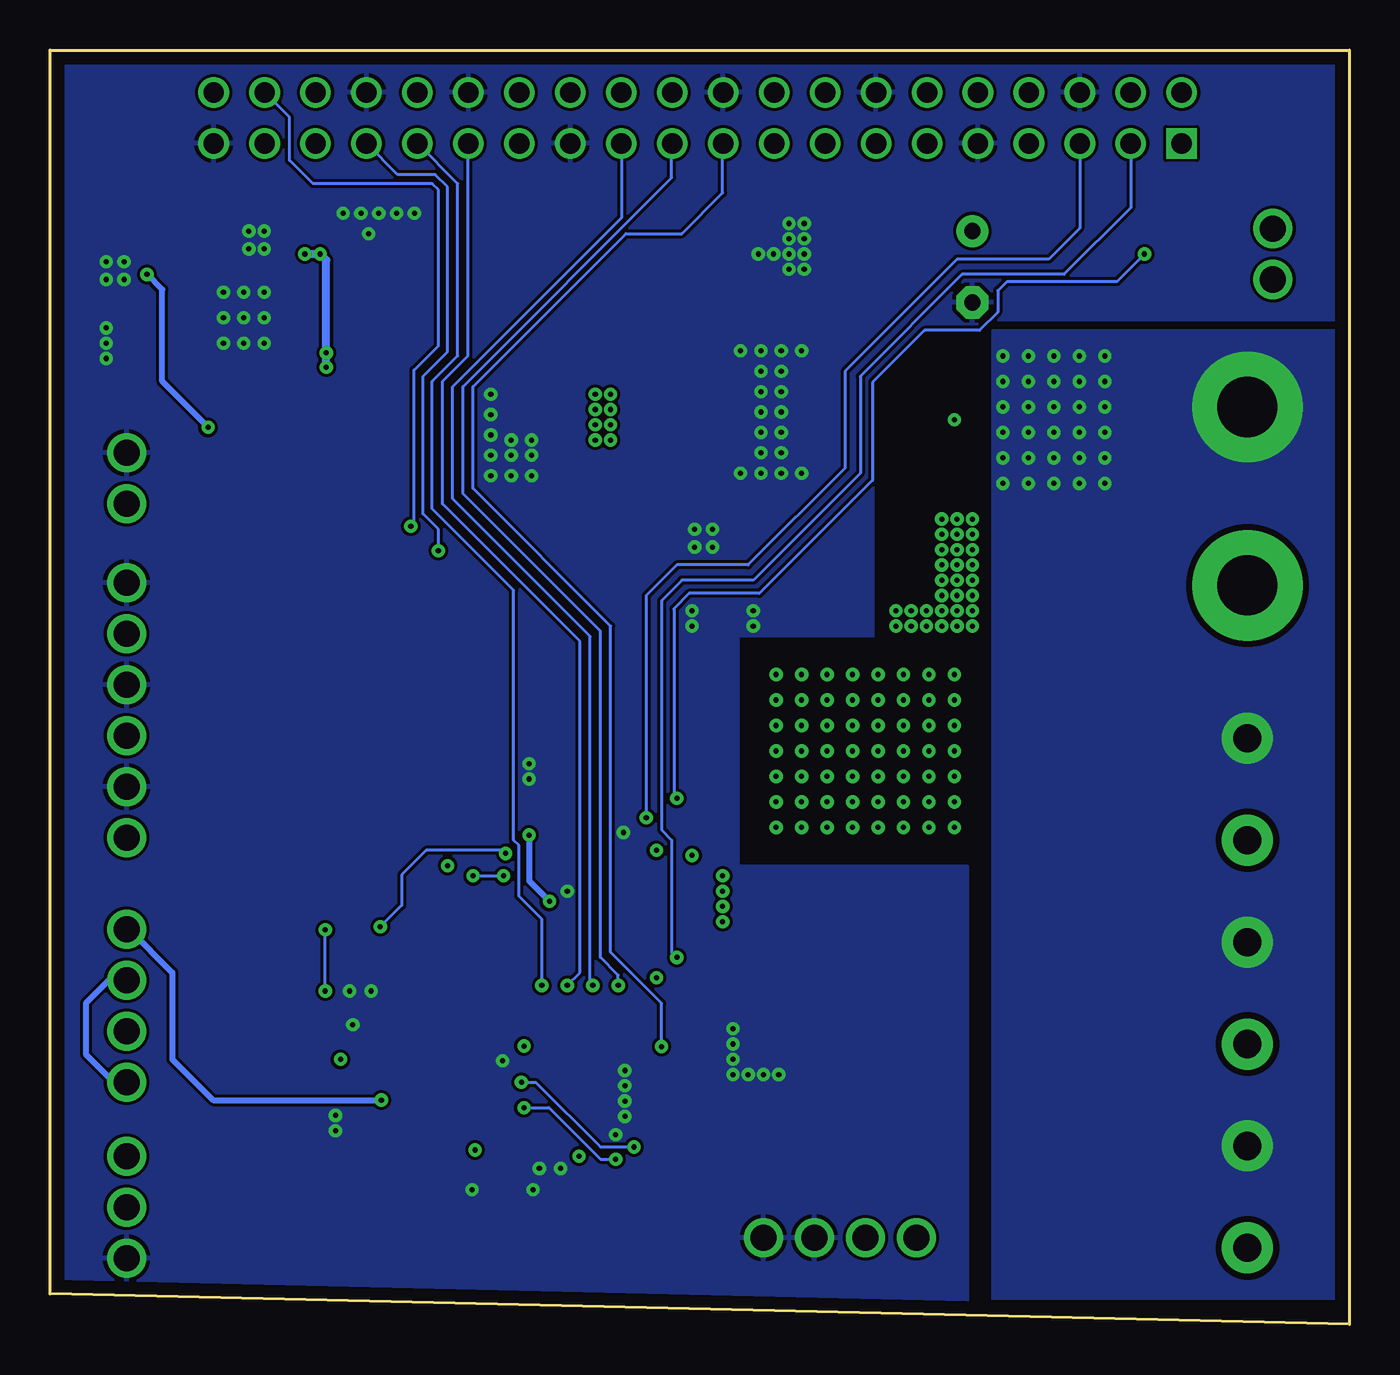
[diagram p8: board, bottom side, seen from below]

Size 64.77 x 63.5 mm. Coordinates in mm from the lower left corner, seen from the top.
Outline: 0,0 64.77,1.52 64.77,63.5 0,63.5 0,0
Copper layers (1*2+15*16): Top 0.035mm / dielectric 1.5mm / Route2 0.035mm / dielectric 0.15mm / Route15 0.035mm / dielectric 0.2mm / Bottom 0.035mm
Design rules "default *": minimum track width 6mil, minimum drill 10mil, track to track 6mil, track to pad 6mil, pad to pad 6mil, via to via 6mil, smd to smd 0mil, copper to edge 25mil, drill to drill 8mil, minimum pad ring 10mil, minimum via ring 8mil, stop-mask expansion 4mil, vias tented up to drill 0mil, thermal gap 8mil
tRestrict: 4 lines

### Footprints (pad centres in the part's own frame; a part is rotated, then mirrored left to right if it is on the bottom)
C0603 = smd 1.1 x 1: 1 -0.85,0; 2 0.85,0
C0402 = smd 0.55 x 0.7: 1 -0.4,0; 2 0.4,0
C0805 = smd 1.3 x 1.5: 1 -0.95,0; 2 0.95,0
C1206 = smd 1.6 x 1.8: 1 -1.4,0; 2 1.4,0
E3,5-8 = drill 0.813 pad 1.6: + -1.778,0 | drill 0.813 pad 1.6 octagon: - 1.778,0
PANASONIC_C = smd 2.6 x 1.4: + 2.05,0; - -2.05,0
C0402' = smd 0.7 x 0.9: 1 -0.65,0; 2 0.65,0
SOT-23 = smd 1 x 1.4: 1 -0.95,-1.1; 2 0.95,-1.1; 3 0,1.1
SMA = smd 2.4 x 2.4: A 2.2,0; C -2.2,0
SOD-123 = smd 1.83 x 1.4: A 1.9,0; K -1.9,0
SMC = smd 2.8 x 3.8: A 3.7,0; C -3.7,0
SOD123FL = smd 0.914 x 1.219: A -1.638,0; K 1.638,0
BETTER_LITTELFUSE1812 = smd 2.286 x 3.302: P$1 2.223,0; P$2 -2.223,0
1MMCIRCLE = smd 1 x 1: P$1 0,0
TSSOP16_PP = smd 0.45 x 1.2: 1 -2.275,-2.918; 2 -1.625,-2.918; 3 -0.975,-2.918; 4 -0.325,-2.918; 5 0.325,-2.918; 6 0.975,-2.918; 7 1.625,-2.918; 8 2.275,-2.918; 9 2.275,2.918; 10 1.625,2.918; 11 0.975,2.918; 12 0.325,2.918; 13 -0.325,2.918; 14 -0.975,2.918; 15 -1.625,2.918; 16 -2.275,2.918 | smd 3.58 x 2.94: PP 0,0
MSOP-16-PP = smd 0.305 x 1.1: 1 -1.75,-2.296; 2 -1.25,-2.296; 3 -0.75,-2.296; 4 -0.25,-2.296; 5 0.25,-2.296; 6 0.75,-2.296; 7 1.25,-2.296; 8 1.75,-2.296; 9 1.75,2.296; 10 1.25,2.296; 11 0.75,2.296; 12 0.25,2.296; 13 -0.25,2.296; 14 -0.75,2.296; 15 -1.25,2.296; 16 -1.75,2.296 | smd 2.845 x 1.651: PP 0,0
MSOP10 = smd 0.3 x 1.5: 1 -1,-2.05; 2 -0.5,-2.05; 3 0,-2.05; 4 0.5,-2.05; 5 1,-2.05; 6 1,2.05; 7 0.5,2.05; 8 0,2.05; 9 -0.5,2.05; 10 -1,2.05
TS8 = smd 0.4 x 1.22: 1 -0.975,-1.31; 2 -0.325,-1.31; 3 0.325,-1.31; 4 0.975,-1.31; 5 0.975,1.31; 6 0.325,1.31; 7 -0.325,1.31; 8 -0.975,1.31
282857-6 = drill 1.4 pad 2.54: 1 -12.7,0; 2 -7.62,0; 3 -2.54,0; 4 2.54,0; 5 7.62,0; 6 12.7,0
OSTVN02A150 = drill 1.3: 1 -1.27,0; 2 1.27,0
OSTVN04A150 = drill 1.3: 1 -3.81,0; 2 -1.27,0; 3 1.27,0; 4 3.81,0
OSTVN06A150 = drill 1.3: 1 -6.35,0; 2 -3.81,0; 3 -1.27,0; 4 1.27,0; 5 3.81,0; 6 6.35,0
OSTVN03A150 = drill 1.3: 1 -2.54,0; 2 0,0; 3 2.54,0
L-4026 = smd 1.2 x 3.7: P$1 -1.4,0; P$2 1.4,0
VLP8040 = smd 3.3 x 8.5: P$1 -2.35,0; P$2 2.35,0
5.5/3,0 = drill 3 pad 5.5: P$1 0,0
RPI3 = drill 1.016 square: P$1 8.37,51.23 | drill 1.016: P$2 8.357,53.772; P$3 10.897,51.232; P$4 10.897,53.772; P$5 13.437,51.232; P$6 13.437,53.772; P$7 15.977,51.232; P$8 15.977,53.772; P$9 18.517,51.232; P$10 18.517,53.772; P$11 21.057,51.232; P$12 21.057,53.772; P$13 23.597,51.232; P$14 23.597,53.772; P$15 26.137,51.232; P$16 26.137,53.772; P$17 28.677,51.232; P$18 28.677,53.772; P$19 31.217,51.232; P$20 31.217,53.772; P$21 33.757,51.232; P$22 33.757,53.772; P$23 36.297,51.232; P$24 36.297,53.772; P$25 38.837,51.232; P$26 38.837,53.772; P$27 41.377,51.232; P$28 41.377,53.772; P$29 43.917,51.232; P$30 43.917,53.772; P$31 46.457,51.232; P$32 46.457,53.772; P$33 48.997,51.232; P$34 48.997,53.772; P$35 51.537,51.232; P$36 51.537,53.772; P$37 54.077,51.232; P$38 54.077,53.772; P$39 56.617,51.232; P$40 56.617,53.772
TO263 = smd 1.5 x 4: 1 -2.54,-6.6; 2 2.54,-6.6 | smd 9.5 x 9: 3 0,3.5
R0603 = smd 1 x 1.1: 1 -0.85,0; 2 0.85,0
R0805 = smd 1.3 x 1.5: 1 -0.95,0; 2 0.95,0
R0402 = smd 0.55 x 0.7: 1 -0.4,0; 2 0.4,0
TSSOP28 = smd 0.305 x 0.991: 1 -4.225,-2.918; 2 -3.575,-2.918; 3 -2.925,-2.918; 4 -2.275,-2.918; 5 -1.625,-2.918; 6 -0.975,-2.918; 7 -0.325,-2.918; 8 0.325,-2.918; 9 0.975,-2.918; 10 1.625,-2.918; 11 2.275,-2.918; 12 2.925,-2.918; 13 3.575,-2.918; 14 4.225,-2.918; 15 4.225,2.918; 16 3.575,2.918; 17 2.925,2.918; 18 2.275,2.918; 19 1.625,2.918; 20 0.975,2.918; 21 0.325,2.918; 22 -0.325,2.918; 23 -0.975,2.918; 24 -1.625,2.918; 25 -2.275,2.918; 26 -2.925,2.918; 27 -3.575,2.918; 28 -4.225,2.918
LGA24-8X4 = smd 0.27 x 0.45: 1 -1.505,1.225; 6 -1.505,-1.225; 7 -1.075,-1.225; 8 -0.645,-1.225; 9 -0.215,-1.225; 10 0.215,-1.225; 11 0.645,-1.225; 12 1.075,-1.225; 13 1.505,-1.225; 18 1.505,1.225; 19 1.075,1.225; 20 0.645,1.225; 21 0.215,1.225; 22 -0.215,1.225; 23 -0.645,1.225; 24 -1.075,1.225 | smd 0.45 x 0.27: 2 -1.475,0.645; 3 -1.475,0.215; 4 -1.475,-0.215; 5 -1.475,-0.645; 14 1.475,-0.645; 15 1.475,-0.215; 16 1.475,0.215; 17 1.475,0.645
R0603@1 = smd 1 x 1.1: 1 -0.85,0; 2 0.85,0

### Placement (x,y rotation side)
C1  50.04,53.34 90 top
C2  60.33,49.78 0 top
C3  52.7,46.48 0 top
C4  49.78,49.53 90 top
C5  57.02,53.98 180 top
C6  26.04,51.18 0 top
C7  34.29,39.12 180 top
C8  33.91,46.74 90 top
C9  30.1,54.36 180 top
C10  34.54,42.93 180 top
C11  40.26,45.47 0 top
C12  46.18,20.32 90 top
C13  51.56,10.79 180 top
C14  18.8,52.7 270 top
C15  46.99,12.19 180 top
C16  48.77,17.78 270 top
C17  51.56,9.65 180 top
C18  48.77,14.48 90 top
C19  47.24,20.32 90 top
C20  39.75,41.02 180 top
C21  40.89,25.65 90 top
C22  27.94,13.97 0 top
C23  60.58,48.39 0 top
C24  40.51,9.02 270 top
C25  37.8,9.4 180 top
C26  42.16,7.75 270 top
C27  39.37,9.02 270 top
C28  42.37,10.41 0 top
C29  0.1uF  [C0402']  25.53,48.51 0 top
C30  42.19,11.89 90 top
C46  38.1,20.83 90 top
C47  35.81,23.62 0 top
D1  21.59,42.55 270 top
D2  47.12,51.44 90 top
D3  32,51.18 180 top
D4  50.04,35.69 0 top
D5  14.61,33.15 90 top
D6  12.7,53.34 270 top
D8  61.21,54.74 0 top
F1  28.83,19.18 270 top
FM1  49.78,3.56 0 top
FM2  18.03,4.32 0 top
FM3  3.56,59.94 0 top
IC1  55.12,50.16 270 top
IC2  28.83,45.47 90 top
IC3  46.61,16.13 0 top
IC16  35.81,20.83 180 top
J1  5.08,16.51 90 top
J2  3.81,53.34 270 top
J3  25.4,4.32 180 top
J4  60.96,30.61 270 top
J5  60.96,5.84 90 top
J6  60.96,15.88 270 top
J7  60.96,42.16 270 top
L1  48.39,45.34 0 top
L2  40.26,51.18 270 top
PAD1  5.08,45.72 0 top
PAD2  5.08,36.83 0 top
PCB1  0,7.62 0 top
Q1  24.13,31.75 180 top
R1  24.13,38.73 90 top
R2  8.64,51.44 270 top
R3  21.84,45.09 0 top
R4  31.24,33.4 90 top
R5  61.21,47.12 180 top
R6  57.02,46.48 0 top
R7  60.83,51.05 180 top
R8  51.05,32.26 0 top
R9  25.02,43.43 90 top
R10  33.91,54.36 0 top
R11  34.54,41.02 0 top
R12  32,41.66 90 top
R13  34.8,18.29 0 top
R14  33.27,22.61 180 top
R15  46.99,11.13 0 top
R16  49.83,17.78 90 top
R17  48.51,8.53 90 top
R18  51.05,33.78 180 top
R19  10.16,51.44 270 top
R20  10.16,54.61 270 top
R21  39.37,26.42 270 top
R22  51.05,27.69 0 top
R23  51.05,29.21 0 top
R24  51.05,30.73 0 top
R25  37.72,15.49 90 top
R26  36.45,15.49 90 top
R27  35.56,13.84 180 top
R28  40.26,15.49 90 top
R29  38.99,15.49 90 top
R30  44.45,12.06 180 top
R31  40.13,33.53 90 top
R51  44.22,14.91 270 top
R65  38.1,19.3 0 top
R66  38.1,22.61 0 top
T1  39.37,29.97 180 top
U1  44.96,29.46 90 top
U6  38.73,11.81 180 top
X1  44.88,20.98 90 top
X2  51.05,12.19 180 top
X3  51.05,8.38 180 top

### Tracks (layer width: path | path; a pad name or v marks a point on that pad's centre or on a via)
3.3V_SCL  (via drill 0.25)
  Top 0.152: v35.05,25.25 33.67,23.87 R14.1 | R14.1 34.8,22.61 34.8,22.18 IC16.4 | U6.2 40.78,11.17 v41.15,10.79 | v36.58,8.23 35.36,8.23 32.92,10.67 32.92,21.34 33.68,22.1 R14.1
  Bottom 0.152: PCB1.P$5 13.44,54.63 14.99,53.09 19.56,53.09 25.15,47.5 25.15,42.67 29.97,37.85 33.53,37.85 35.05,36.32 v35.05,25.25 | v41.15,10.79 39.9,10.79 37.34,8.23 v36.58,8.23
3.3V_SDA  (via drill 0.25)
  Top 0.152: IC16.5 34.84,19.09 34.54,18.8 34.54,18.43 R13.1 v33.53,18.29 33.53,10.97 v35.66,8.84 | U6.4 41.24,12.03 v41.27,12.06
  Bottom 0.152: PCB1.P$3 10.9,55.65 14.22,52.32 19.3,52.32 24.38,47.24 24.38,42.42 29.72,37.08 33.27,37.08 34.29,36.07 34.29,24.64 33.78,24.13 33.78,18.54 v33.53,18.29 | v41.27,12.06 40.56,12.06 37.34,8.84 v35.66,8.84
5V_SCL  (via drill 0.25)
  Top 0.152: U1.26 42.8,26.54 43.43,25.91 43.43,22.35 | 43.43,22.35 43.43,18.29 43.69,18.03 45.46,18.03 IC3.10 | v43.69,22.35 43.43,22.35 | v42.16,22.35 40.13,22.35 39.12,23.37 37.85,23.37 37.59,23.11 37.59,22.71 R66.1 37.08,22.61 36.83,22.35 36.83,22.18 IC16.1
  Bottom 0.152: v43.69,22.35 v42.16,22.35
5V_SDA
  Top 0.152: U1.27 42.69,25.89 42.93,25.65 42.93,18.54 | 42.93,18.54 42.93,17.27 43.18,17.02 45.97,17.02 46.11,17.15 IC3.9 | 42.93,18.54 37.85,18.54 37.7,18.69 R65.1 36.83,19.3 36.83,19.48 IC16.8
+3V3  (via drill 0.25)
  Top 0.152: U6.8 39.38,13.78 39.47,13.87 39.78,13.87 | 39.78,13.87 40.23,13.87 | 40.23,13.87 40.69,13.87 | U6.7 39.81,13.84 39.78,13.87 | U6.6 40.24,13.86 40.23,13.87 | U6.5 40.65,12.46 40.69,12.5 40.69,13.87 | 40.69,13.87 v41.15,13.87
  Top 0.203: U6.3 40.85,11.6 41.02,11.43 42.13,11.43 C30.1 43.02,11.49 R30.2 43.58,12.04 43.43,12.04 43.28,12.19 43.28,13.41 42.82,13.87 v41.15,13.87 | v43.59,8.69 42.17,8.69 C26.1 41.97,8.89 41.97,10.06 | C28.1 41.97,10.06 | U6.1 40.24,10.2 40.39,10.06 41.97,10.06 | U6.23 39.38,10.12 39.32,10.06 39.17,10.06 | U6.22 38.95,10.12 39.01,10.06 39.17,10.06 | C27.1 39.13,9.42 | 39.13,9.42 38.76,9.04 38.76,8.74 v38.41,8.38 | 39.13,9.42 39.13,10.03 39.17,10.06
  Top 0.305: IC16.6 35.49,18.58 R13.2 35.2,17.89 v34.54,17.27 | v32.77,23.37 32.77,22.71 R14.2 | IC16.3 35.49,23.55 C47.1 v34.54,23.62
  pour Route15: 6.86,59.69 6.86,57.4 32.51,57.4 32.51,0.76 44.2,0.76 44.2,23.62 35.05,23.62 35.05,59.69
+5V  (via drill 0.25)
  Top 0.152: C21.1 39.68,25.25 R21.2
  Top 0.254: IC2.3 34.53,44.72 35.31,43.94 35.31,43.01 | C10.1 R11.2
  Top 0.305: 35.31,43.01 C10.1 36.83,42.93 | X3.2 50.2,8.47 49.78,8.89 49.78,11.77 X2.2 50.2,13.12 v50.29,13.21 | X1.2 44.88,22.78 v44.96,22.86 | v40.89,24.38 C21.1 40.91,25.24 U1.28 | R65.2 38.5,20.28 | 38.5,20.28 38.35,20.43 C46.1 37.48,20.43 37.34,20.57 36.32,20.57 36.14,20.39 IC16.7 | R66.2 39.12,22.61 39.88,21.84 v39.88,21.08 39.08,20.28 38.5,20.28
  Bottom 0.305: v40.89,24.38 40.89,22.1 v39.88,21.08
  other vias: 36.83,46.35 37.59,46.35 37.59,45.59 36.83,45.59 36.83,44.83 37.59,44.83 37.59,44.07 36.83,44.07
  pour Top (no thermals): 44.45,50.42 35.94,50.42 35.94,47.12 36.45,47.12 36.45,40.39 40.01,40.39 40.01,47.24 44.45,47.24
  pour Route15: 6.86,63.5 6.86,60.2 35.56,60.2 35.56,24.13 44.7,24.13 44.7,1.02 64.77,1.02 64.77,63.5
ADC_DRDY  (via drill 0.25)
  Top 0.152: R30.1 45.43,12.19 45.47,12.19 46.11,12.84 IC3.2 46.11,15.48 46.48,15.85 50.29,15.85 v51.05,16.61 | v51.05,19.66 45.41,25.3 v45.41,38.56
  Bottom 0.152: v51.05,16.61 v51.05,19.66 | v45.41,38.56 45.41,39.62 46.18,40.39 46.18,47.24 44.96,48.46 44.96,56.69 45.57,57.3 47.45,57.3 PCB1.P$33
BAT_ADC  (via drill 0.25)
  Top 0.152: v33.53,26.21 36.58,26.21 38.41,24.38 39.17,24.38 40.08,23.47 v42.06,23.47 | v48.31,19.81 47.35,19.81 C19.1 47.11,19.79 IC3.7 | R19.1 10.16,53.29 v10.21,53.34 10.16,53.39 R20.2
  Bottom 0.152: v10.21,53.34 11.58,51.97 17.07,51.97 17.53,51.51 17.53,50.44 18.44,49.53 21.18,49.53 23.77,46.94 23.77,42.06 29.41,36.42 32.92,36.42 33.68,35.66 33.68,26.36 v33.53,26.21 | v42.06,23.47 42.22,23.62 46.02,23.62 47.24,22.4 47.24,20.88 v48.31,19.81
DEN  (via drill 0.25)
  Top 0.152: R27.2 v34.29,13.84
  Bottom 0.152: v34.29,13.84 34.29,16 36.83,18.54 36.83,34.8 43.69,41.66 43.69,46.74 36.07,54.36 33.27,54.36 31.24,56.39 31.24,58.83 PCB1.P$19
DRDY_M  (via drill 0.25)
  Top 0.152: R28.2 v40.26,16.89
  Bottom 0.152: v40.26,16.89 40.26,20.19 41.4,21.34 41.4,23.88 41.66,24.13 41.66,36.58 45.72,40.64 45.72,46.99 44.45,48.26 44.45,56.84 PCB1.P$31
ESC/LED_OE  (via drill 0.25)
  Top 0.152: R31.2 40.13,35.71 44.2,39.78 v46.79,39.78
  Bottom 0.152: v46.79,39.78 46.63,39.93 46.63,47.55 45.41,48.77 45.41,56.54 45.72,56.84 51.66,56.84 52.83,58.01 52.83,60.15 PCB1.P$38
GND  (via drill 0.25)
  Top 0.152: IC2.16 28.32,43.72 v28.32,43.43 | R9.1 27.14,42.58 v27.3,42.42
  Top 0.203: U6.20 38.09,10.2 37.95,10.06 37.64,10.06 | 37.64,10.06 37.34,10.06 | U6.18 37.23,10.17 37.34,10.06 | U6.19 37.66,10.08 37.64,10.06 | 37.19,10.06 37.34,10.06 | 37.34,10.06 37.34,9.46 C25.2 | U6.17 36.46,11.17 36.42,11.12 | U6.16 36.44,11.6 36.42,11.58 | U6.15 36.44,12.03 36.42,12.04 | U6.14 36.46,12.46 36.42,12.5
  Top 0.305: IC3.3 46.61,12.21 C15.2
  Top 0.406: IC1.8 54.09,47.89 54.1,47.88 54.1,48.77 | 53.98,48.64 53.98,49.02 IC1.PP 56.01,51.05 56.01,51.44 56.36,51.79 IC1.15
  other vias: 29.34,45.47 28.32,45.47 29.34,44.45 28.32,44.45 29.34,43.43 29.34,46.48 28.32,46.48 29.34,47.5 28.32,47.5 29.34,42.42 28.32,42.42 30.35,42.42 29.34,48.51 28.32,48.51 27.3,48.51 30.35,48.51 32.64,38.73 32.64,39.62 31.75,39.62 31.75,38.73 27.94,52.58 27.94,53.34 27.94,54.1 27.94,54.86 27.18,52.58 27.18,53.34 27.18,54.1 27.18,54.86 28.7,53.34 29.46,53.34 42.8,42.29 41.78,42.29 40.77,42.29 40.77,43.31 41.78,43.31 42.8,43.31 42.8,44.32 42.8,45.34 42.8,46.35 41.78,44.07 40.77,44.07 46.61,55.37 47.5,55.37 48.39,55.37 49.28,55.37 50.16,55.37 54.86,54.48 54.86,53.59 54.1,53.59 54.1,54.48 55.12,50.16 55.12,51.44 54.1,51.44 56.13,51.44 56.13,50.16 54.1,50.16 54.1,48.9 55.12,48.9 56.13,48.9 61.98,48.13 61.98,48.9 61.98,49.66 61.98,52.07 61.09,52.07 61.09,52.96 61.98,52.96 48.9,54.36 30.73,13.97 30.73,13.21 30.73,14.73 28.45,12.45 29.21,12.45 29.97,12.45 30.73,12.45 29.72,34.8 29.72,35.56 32.77,35.56 32.77,34.8 50.55,10.41 50.55,9.65 40.89,27.18 40.89,27.94 38.99,21.59 36.2,24.51 42.21,13.13 39.32,7.77 40.39,7.77 36.12,12.65 36.12,11.89 36.12,11.13 36.12,10.36 36.58,9.45 40.69,6.71 43.74,6.71 48.77,16.61 49.83,16.61 49.68,14.94
  pour Top (no thermals): 29.9,43.31 29.9,47.62 30.73,47.62 30.73,49.15 25.78,49.15 25.78,47.62 27.76,47.62 27.76,43.31 26.92,43.31 26.92,42.04 30.73,42.04 30.73,43.31
  pour Top (no thermals): 31.5,49.53 31.5,53.47 30.1,53.47 30.1,55.24 26.42,55.24 26.42,49.53
  pour Top (no thermals): 40.39,39.88 40.39,46.86 43.43,46.86 43.43,39.88
  pour Top (no thermals): 34.16,38.48 34.16,40.13 32.64,40.13 32.64,41.27 31.37,41.27 31.37,38.48
  pour Top (no thermals): 52.76,47.88 52.76,45.77 56.9,45.77 56.9,54.89 53.47,54.89 53.47,47.88
  pour Top (no thermals): 45.72,52.45 48.26,52.45 48.26,53.59 50.55,53.59 50.55,55.75 45.72,55.75
  pour Top (no thermals): 61.47,46.61 62.61,46.61 62.61,53.34 60.71,53.34 60.71,50.29 60.45,50.04 60.45,49.02 60.71,48.77 60.71,48.01 61.47,48.01
  pour Top (no thermals): 60.71,53.34 60.71,54.1 59.18,54.1 59.18,55.37 61.59,55.37 61.98,54.99 61.98,53.85 62.61,53.85 62.61,53.34
  pour Top (rank 6): 0,50.16 11.43,50.16 11.43,41.27 23.5,41.27 23.5,33.66 29.84,33.66 29.84,22.86 25.4,22.86 25.4,9.53 20.32,9.53 20.32,0 64.77,0 64.77,63.5 0,63.5
  pour Bottom: 0,50.04 18.29,50.04 18.29,46.35 23.75,46.35 23.75,34.29 30.48,34.29 30.48,22.86 19.05,22.86 19.05,0 64.77,0 64.77,63.5 0,63.5
  pour Top (no thermals): 49.28,9.27 51.44,9.27 51.44,11.3 49.28,11.3
  pour Route2: 0,50.04 18.29,50.04 18.29,46.35 23.75,46.35 23.75,34.29 30.48,34.29 30.48,15.24 27.94,15.24 27.94,9.53 20.32,9.53 20.32,0 64.77,0 64.77,63.5 0,63.5
GNDIO  (via drill 0.25)
  Top 1.27: R4.1 28.57,32.45 v28.57,32.38
  other vias: 19.68,32.38 20.95,32.38 22.23,32.38 23.5,32.38 24.77,32.38 26.04,32.38 27.3,32.38 28.57,31.11 27.3,31.11 26.04,31.11 24.77,31.11 23.5,31.11 22.23,31.11 20.95,31.11 19.68,31.11 28.57,29.84 27.3,29.84 26.04,29.84 24.77,29.84 23.5,29.84 22.23,29.84 20.95,29.84 19.68,29.84 28.57,28.57 27.3,28.57 26.04,28.57 24.77,28.57 23.5,28.57 22.23,28.57 20.95,28.57 19.68,28.57 28.57,27.3 27.3,27.3 26.04,27.3 24.77,27.3 23.5,27.3 22.23,27.3 20.95,27.3 19.68,27.3 28.57,26.04 27.3,26.04 26.04,26.04 24.77,26.04 23.5,26.04 22.23,26.04 20.95,26.04 19.68,26.04 28.57,24.77 27.3,24.77 26.04,24.77 24.77,24.77 23.5,24.77 22.23,24.77 20.95,24.77 19.68,24.77
  pour Top (isolate 0.305, no thermals): 19.05,33.02 29.21,33.02 29.21,23.5 24.77,23.5 24.77,10.16 19.68,10.16 19.68,0 0,0 0,31.11 19.05,31.11
  pour Route2 (isolate 0.305, no thermals): 19.05,33.02 29.21,33.02 29.21,15.88 27.3,15.88 27.3,10.16 19.68,10.16 19.68,0 0,0 0,31.11 19.05,31.11
INT1  (via drill 0.25)
  Top 0.152: R25.2 v37.72,16.89
  Bottom 0.152: v37.72,16.89 37.85,17.02 37.85,34.29 44.7,41.15 44.7,46.74 36.3,55.14 PCB1.P$23
INT2  (via drill 0.25)
  Top 0.152: R26.2 v36.45,16.89
  Bottom 0.152: v36.45,16.89 36.45,17.4 37.34,18.29 37.34,34.54 44.2,41.4 44.2,46.74 33.78,57.15 33.78,58.83 PCB1.P$21
INT_M  (via drill 0.25)
  Top 0.152: R29.2 v38.99,16.89
  Bottom 0.152: v38.99,16.89 38.35,17.53 38.35,34.04 45.21,40.89 45.21,46.99 43.94,48.26 43.94,58.83 PCB1.P$29
N$1  (via drill 0.25)
  Top 0.254: 21.59,37.88 Q1.2
  Top 0.406: D1.1 21.59,43.49 21.59,40.13 v20.32,40.13
  Top 0.635: R1.1 21.59,37.88
  other vias: 20.32,39.37 20.32,38.61 20.32,37.85 20.32,37.08 20.32,36.32 20.32,35.56 20.32,34.8 21.08,34.8 21.84,34.8 22.61,34.8 22.61,35.56 21.84,35.56 21.08,35.56 18.8,40.13 18.8,39.37 18.8,38.61 18.8,37.85 18.8,37.08 18.8,36.32 18.8,35.56 18.8,34.8 19.56,40.13 19.56,39.37 19.56,38.61 19.56,37.85 19.56,37.08 19.56,36.32 19.56,35.56 19.56,34.8
  pour Top (isolate 0.305, no thermals): 0,31.75 18.41,31.75 18.41,34.29 22.86,34.29 22.86,40.64 0,40.64
  pour Route2 (isolate 0.305, no thermals): 0,31.75 18.41,31.75 18.41,34.29 22.86,34.29 22.86,40.64 0,40.64
N$2
  Top 0.254: IC1.9 58.04,46.65 R6.2
N$3
  Top 0.152: R21.1 39.37,28.7 | 39.37,28.7 T1.3 | U1.23 41.36,28.49 41.15,28.7 39.37,28.7
N$4
  Top 0.305: J2.1 7.11,54.61 8.64,53.09 R2.1
N$5  (via drill 0.25)
  Top 0.305: v19.68,45.09 R3.1
  Route15 0.305: J2.2 15.88,52.07 19.05,48.9 19.05,45.72 v19.68,45.09
N$6
  Top 0.254: IC1.12 59.87,49.84 C2.1
N$7
  Top 0.406: IC1.3 53.21,51.14 53.21,55.37 54.15,56.31 61.54,56.31 62.85,55 D8.K 63.25,54.34 63.25,43.18 J7.2
N$8  (via drill 0.25)
  Bottom 0.406: v51,47.7 v51,48.41 51,53.03 v51.31,53.34 v52.07,53.34
  pour Top (no thermals): 52.73,51.94 52.73,51.61 50.93,51.61 50.93,53.72 52.45,53.72 52.45,53.09 51.31,53.09 51.31,51.94
  pour Top (no thermals): 52.83,48.72 52.83,48.39 51.31,48.39 51.31,47.37 52.45,47.37 52.45,45.97 50.42,45.97 50.42,43.43 49.15,43.43 49.15,47.75 50.67,47.75 50.67,48.72
N$9
  pour Top (no thermals): 52.83,49.66 48.39,49.66 48.39,43.43 46.35,43.43 46.35,47.62 45.97,48.01 45.97,51.05 50.04,51.05 51.05,50.04 52.83,50.04
N$10
  Top 0.406: IC1.6 50.21,49.19 49.91,48.9 49.91,48.81 C4.1
N$11  (via drill 0.25)
  Top 0.254: 59.94,51.09 R7.2 59.42,50.49 IC1.13
  Top 0.305: v56.9,44.7 56.9,36.07 53.09,32.26 R8.2 | 59.94,51.09 v59.94,52.32 59.94,52.53 58.5,53.98 C5.1
  Bottom 0.305: v56.9,44.7 59.18,46.99 59.18,51.56 v59.94,52.32
N$12  (via drill 0.25)
  other vias: 17.27,41.91 16,41.91 14.73,41.91 13.46,41.91 12.19,41.91 12.19,43.18 12.19,44.45 12.19,45.72 12.19,46.99 12.19,48.26 13.46,48.26 14.73,48.26 16,48.26 17.27,48.26 17.27,46.99 17.27,45.72 17.27,44.45 17.27,43.18 16,43.18 16,44.45 16,45.72 16,46.99 14.73,46.99 14.73,45.72 14.73,44.45 14.73,43.18 13.46,43.18 13.46,44.45 13.46,45.72 13.46,46.99
  pour Bottom (isolate 0.305, no thermals): 0,49.53 0,1.27 17.78,1.27 17.78,49.53
  pour Route15 (isolate 0.305, no thermals): 0,49.53 0,1.27 17.78,1.27 17.78,49.53
  pour Top (isolate 0.305, no thermals): 0,41.4 17.78,41.4 17.78,52.32 11.43,52.32 11.43,51.05 8.13,51.05 8.13,49.53 0,49.53
N$13
  Top 0.152: IC2.2 34.02,44.22 34.54,43.69 34.54,39.46 C7.1
N$14
  Top 0.152: IC2.14 25.02,44.72 R9.2
N$15
  Top 0.635: R10.2 34.76,51.22 34.8,51.18 D3.C
  pour Top (no thermals): 30.61,45.59 32.89,45.59 33.02,45.72 33.02,46.74 35.43,46.74 35.43,51.94 44.58,51.94 44.58,55.24 33.91,55.24 33.91,53.21 32.13,53.21 32.13,46.81 30.61,46.81
N$16
  Top 0.305: IC2.4 33.28,45.22 33.78,45.72 33.78,45.76 C8.1
N$17
  Top 0.635: C9.1 R10.1
N$18
  Top 0.152: IC2.1 31.59,43.72 32,43.31 R12.2 33.23,42.51 33.4,42.67 33.44,42.67 C10.2 R11.1
N$19  (via drill 0.25)
  Top 0.305: v48.26,11.18 47.44,11.18 R15.2 C15.1 47.39,12.81 47.11,13.09 IC3.4
  Bottom 0.305: J6.1 60.83,19.68 58.67,17.53 58.67,13.21 56.64,11.18 v48.26,11.18
N$20
  Top 0.305: IC3.6 C16.1 R16.2 51.16,18.18 54.86,14.48 60.83,14.48 J6.3
N$21
  Top 0.305: C13.1 51.9,10.85 X2.1 60.96,12.19 J6.4
  Bottom 0.305: J6.2 61.85,17.14 62.99,16 62.99,13.46 61.72,12.19 60.96,12.19 J6.4
N$22
  Top 0.305: J5.3 X3.1 51.96,8.44 C17.1
N$23
  Top 0.305: IC3.8 46.61,19.07 46.18,19.51 C12.1 45.09,19.92 X1.1
N$24
  Top 0.305: J5.2 50.36,5.84 R17.1
N$25
  Top 0.152: IC3.5 C18.1 48.91,14.08 49.02,13.97 49.02,9.89 R17.2
N$26
  Top 0.254: 26.67,39.62 Q1.1
  pour Top (isolate 0.305, no thermals): 23.37,39.12 25.15,39.12 25.15,36.32 27.43,36.32 27.43,41.4 24.13,41.4 24.13,44.65 23.16,44.65 23.16,45.72 22.1,45.72 22.1,41.15 23.37,41.15
N$27
  Top 0.305: U1.6 48.98,28.49 49.78,27.69 R22.1
N$28
  Top 0.305: U1.7 50.13,29.14 R23.1
N$29
  Top 0.305: U1.8 49.09,29.79 49.78,30.48 49.95,30.48 R24.1
N$30
  Top 0.254: R8.1 50.2,33.33 R18.2
  Top 0.305: U1.9 48.73,30.44 49.02,30.73 49.02,32 49.28,32.26 R8.1
N$31
  Top 0.305: J4.6 57.28,24.26 53.85,27.69 R22.2
N$32
  Top 0.152: U6.11 38.09,13.73 37.72,14.1 R25.1
N$33
  Top 0.152: U6.12 37.66,13.39 36.45,14.61 R26.1
N$34
  Top 0.305: J4.4 52.03,29.34 R23.2
N$35
  Top 0.305: J4.2 57.53,34.42 53.85,30.73 R24.2
N$36
  Top 0.152: 60.35,47.1 R5.2
  Top 0.254: IC1.10 60.03,48.54 C23.1 60.18,47.3 R5.2 | D4.K 48.14,38.23 55.32,45.41 59.89,45.41 60.35,45.87 60.35,47.1
N$37
  Top 0.152: 51.45,35.2 D4.A
  Top 0.254: R18.1 51.45,35.2
N$38
  Top 0.152: U6.13 37.23,13.32 36.83,13.72 36.09,13.72 R27.1
N$39
  Top 0.152: U6.9 38.95,13.8 39.37,14.22 39.88,14.22 40.26,14.61 R28.1
N$40
  Top 0.152: U6.10 38.52,14.14 38.99,14.61 R29.1
N$41
  Top 0.152: T1.1 40.32,32.95 R31.1
N$42
  Top 0.203: U6.24 39.81,10.03 40.39,9.45 40.48,9.45 C24.1
N$43
  Top 0.203: U6.21 38.52,9.72 C25.1
N$44
  pour Top (isolate 0.305, no thermals): 20.32,0.64 25.4,0.64 25.4,7.62 27.3,7.62 27.3,15.88 30.48,15.88 30.48,18.41 25.4,18.41 25.4,9.53 20.32,9.53
N$79
  Top 0.152: IC3.1 44.24,14.08 R51.2
VCC  (via drill 0.25)
  Top 0.406: IC1.4 51.36,50.49 50.29,51.56 50.29,52.32 50.2,52.32 C1.1 50.04,52.45 49.4,51.82 45.41,51.82 45.26,51.97 45.26,55.93 45.11,56.08 24.69,56.08
  Route15 1.27: v31.24,20.07 v31.24,20.83 v31.24,21.59 v31.24,22.35 31.24,35.81 20.83,46.23 20.83,52.45 C14.+
  pour Top (no thermals): 25.4,46.84 25.4,52.07 23.75,52.07 23.75,45.14 27.05,45.14 27.05,46.84
  pour Top (isolate 0.305, no thermals): 11.43,56.9 25.4,56.9 25.4,52.07 23.88,52.07 23.88,46.35 18.29,46.35 18.29,52.83 11.43,52.83
  pour Top (no thermals): 25.4,19.81 31.5,19.81 31.5,22.61 25.4,22.61

### Text on the board
tPlace: LED- | LED+ | GND | ESC1 | GND | ESC2 | ESC+ | GND | GND | ESC3 | ESC+ | THM1 | GND | THM2 | ESC+ | POE+ | POE+ | GND | GND | +5V | PRESSURE | GND | GND